# EAGLE design SmartSpeedo (EAGLE 6.4)
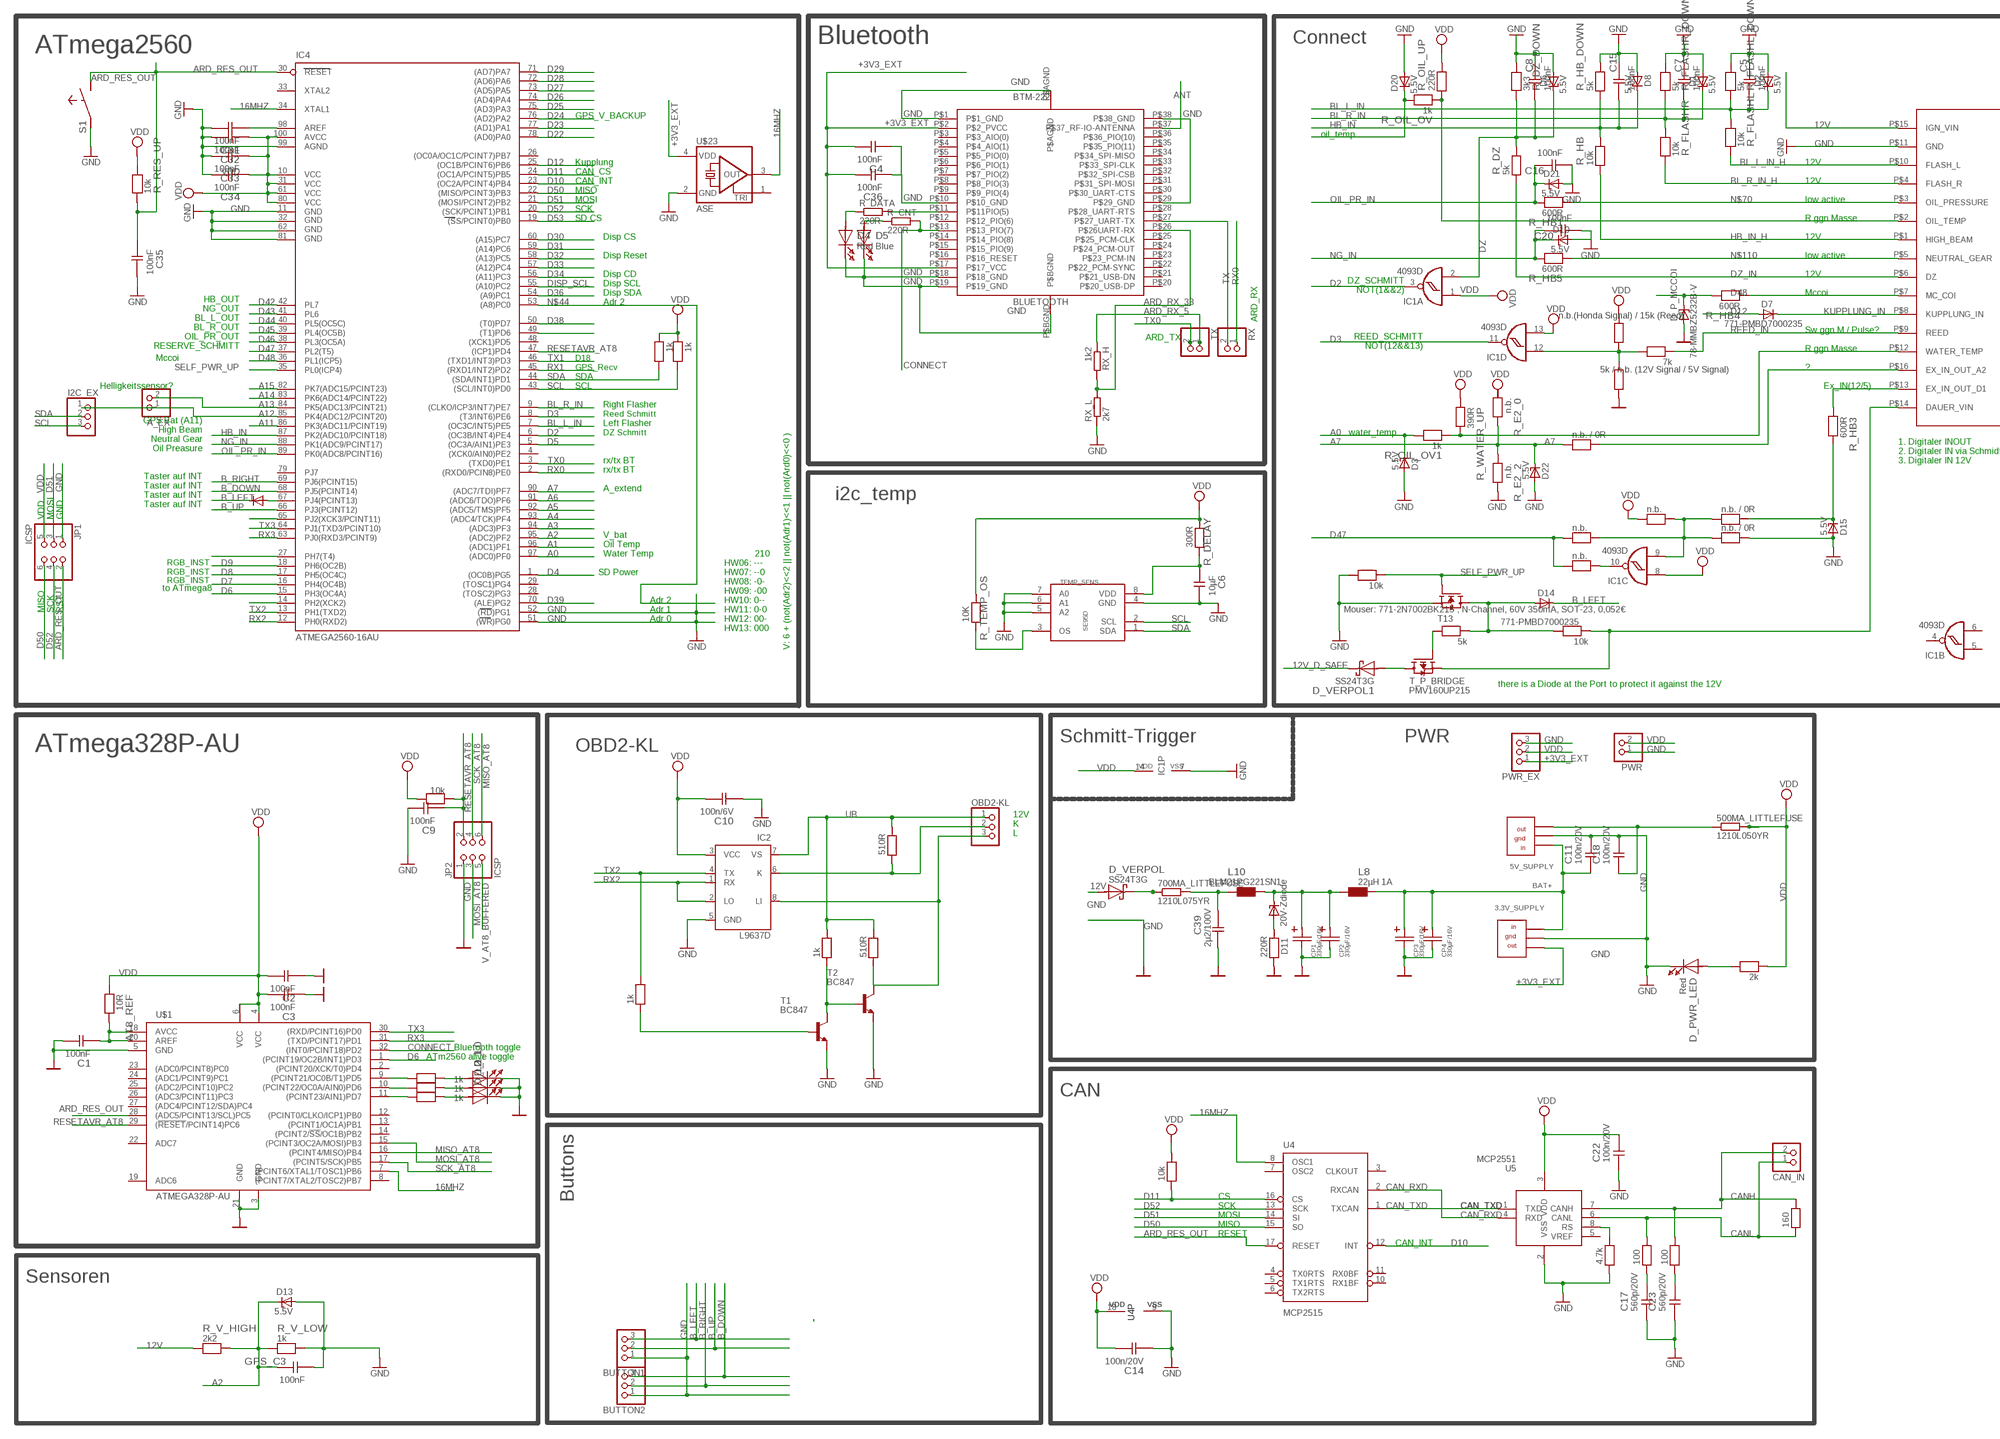
[diagram p0: schematic, sheet 1, part 1 of 2]
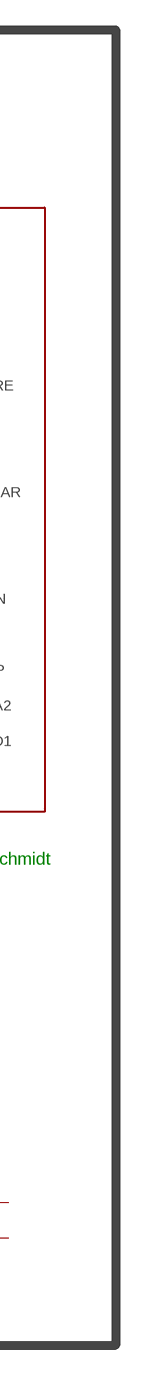
[diagram p1: schematic, sheet 1, part 2 of 2]

## Parts
3.3V_SUPPLY  OKI78SR3.31.5WHC  OKI-78SR  [OKI-78SR]
5V_SUPPLY  OKI78SR51.5W36HC  OKI-78SR  [OKI-78SR]
500MA_LITTLEFUSE  1210L050YR  R-EU_R1210  [R1210]
700MA_LITTLEFUSE  1210L075YR  R-EU_R1210  [R1210]
A_EX  PINHD-1X2  [1X02]
AT8_REF  10R  R0805  [0805]
BLUETOOTH  BTM-222  [BTM-222]
BUTTON1  PINHD-1X3  [1X03]
BUTTON2  PINHD-1X3  [1X03]
C1  100nF  C0805  [0805]
C2  100nF  C0805  [0805]
C3  100nF  C0805  [0805]
C4  100nF  C0805  [0805]
C5  100nF  C0805  [0805]
C6  10µF  C0805  [0805]
C7  100nF  C0805  [0805]
C8  100nF  C0805  [0805]
C9  100nF  C0805  [0805]
C10  100n/6V  C0805  [0805]
C11  100n/20V  C0805  [0805]
C14  100n/20V  C0805  [0805]
C15  100nF  C0805  [0805]
C16  100nF  C0805  [0805]
C17  560p/20V  C0805  [0805]
C18  100n/20V  C0805  [0805]
C20  100nF  C0805  [0805]
C22  100n/20V  C0805  [0805]
C23  560p/20V  C0805  [0805]
C31  100nF  C0805  [0805]
C32  100nF  C0805  [0805]
C33  100nF  C0805  [0805]
C34  100nF  C0805  [0805]
C35  100nF  C0805  [0805]
C36  100nF  C0805  [0805]
C39  2µ2/100V  C0805  [0805]
CAN_IN  PINHD-1X2  [1X02]
CP1  330µF/16V  C_SMD_SMP  [SMD/SMT_6.6/6.6]
CP2  330µF/16V  C_SMD_SMP  [SMD/SMT_6.6/6.6]
CP3  330µF/16V  C_SMD_SMP  [SMD/SMT_6.6/6.6]
CP4  330µF/16V  C_SMD_SMP  [SMD/SMT_6.6/6.6]
D1  5.5V  ZENER-DIODESOT23  [SOT23]
D2  5.5V  ZENER-DIODESOT23  [SOT23]
D3  5.5V  ZENER-DIODESOT23  [SOT23]
D4  Red  LED0805  [LED-0805]
D5  Blue  LED0805  [LED-0805]
D6  5.5V  ZENER-DIODESOT23  [SOT23]
D7  771-PMBD7000235  D-A1-C3  [SOT23]
D8  5.5V  ZENER-DIODESOT23  [SOT23]
D10  5.5V  ZENER-DIODESOT23  [SOT23]
D11  20V-Zdiode  ZENER-DIODESOT23  [SOT23]
D12  771-PMBD7000235  D-A1-C3  [SOT23]
D13  5.5V  ZENER-DIODESOT23  [SOT23]
D14  771-PMBD7000235  D-A1-C3  [SOT23]
D15  5.5V  ZENER-DIODESOT23  [SOT23]
D20  5.5V  ZENER-DIODESOT23  [SOT23]
D21  5.5V  ZENER-DIODESOT23  [SOT23]
D22  5.5V  ZENER-DIODESOT23  [SOT23]
D_L0  LED0805  [LED-0805]
D_L1  LED0805  [LED-0805]
D_L2  LED0805  [LED-0805]
D_P_MCCOI  78-MMBZ5232B-V  ZENER-DIODESOT23  [SOT23]
D_PWR_LED  Red  LED0805  [LED-0805]
D_VERPOL  SS24T3G  D-SSMB-A+K  [SMB]
D_VERPOL1  SS24T3G  D-SSMB-A+K  [SMB]
GPS_C3  100nF  C0805  [0805]
I2C_EX  PINHD-1X3  [1X03]
IC1  4093D  [SO14]
IC2  L9637D  [SO08]
IC4  ATMEGA2560-16AU  [TQFP100]
JP1  ICSP  PINHD-2X3  [2X03]
JP2  ICSP  PINHD-2X3  [2X03]
K_PU  510R  R0805  [0805]
L8  22µH 1A  LPD54  [L-PD54]
L10  BLM21PG221SN1  L0808+0603  [0805+603]
OBD2-KL  PINHD-1X3  [1X03]
PWR  PINHD-1X2  [1X02]
PWR_EX  PINHD-1X3  [1X03]
R1  160  R0805  [0805]
R2  10k  R0805  [0805]
R10  100  R0805  [0805]
R12  100  R0805  [0805]
R13  4.7k  R0805  [0805]
R_CNT  220R  R-EU_M0805  [M0805]
R_DATA  220R  R-EU_M0805  [M0805]
R_DEAKT_DAUER_P  10k  R0805  [0805]
R_DEAKT_DAUER_P1  10k  R0805  [0805]
R_DEAKT_DAUER_P2  5k  R0805  [0805]
R_DELAY  300R  R0805  [0805]
R_DZ  5k  R0805  [0805]
R_DZ_DOWN  3k3  R0805  [0805]
R_E1_0  n.b.  R0805  [0805]
R_E1_1  n.b. / 0R  R0805  [0805]
R_E1_2  n.b.  R0805  [0805]
R_E1_3  n.b. / 0R  R0805  [0805]
R_E1_4  n.b.  R0805  [0805]
R_E2_0  n.b.  R0805  [0805]
R_E2_1  n.b. / 0R  R0805  [0805]
R_E2_2  n.b.  R0805  [0805]
R_FLASHL  10k  R0805  [0805]
R_FLASHL_DOWN  5k  R0805  [0805]
R_FLASHR  10k  R0805  [0805]
R_FLASHR_DOWN  5k  R0805  [0805]
R_HB  10k  R0805  [0805]
R_HB1  600R  R0805  [0805]
R_HB3  600R  R0805  [0805]
R_HB4  600R  R0805  [0805]
R_HB5  600R  R0805  [0805]
R_HB_DOWN  5k  R0805  [0805]
R_L0  1k  R0805  [0805]
R_L1  1k  R0805  [0805]
R_L2  1k  R0805  [0805]
R_L3  10k  R0805  [0805]
R_LED_5V  2k  R0805  [0805]
R_OIL_OV  1k  R0805  [0805]
R_OIL_OV1  1k  R0805  [0805]
R_OIL_UP  220R  R0805  [0805]
R_R_LED_12  220R  R0805  [0805]
R_REED  7k  R0805  [0805]
R_REED_DOWN  5k / n.b. (12V Signal / 5V Signal)  R0805  [0805]
R_REED_UP  n.b.(Honda Signal) / 15k (Reed)  R0805  [0805]
R_RES_UP  10k  R0805  [0805]
R_SCL_UP  1k  R0805  [0805]
R_SDA_UP  1k  R0805  [0805]
R_TEMP_OS  10K  R0805  [0805]
R_V_HIGH  2k2  R0805  [0805]
R_V_LOW  1k  R0805  [0805]
R_WATER_UP  390R  R0805  [0805]
RX  PINHD-1X2  [1X02]
RX_H  1k2  R-EU_M0805  [M0805]
RX_L  2k7  R-EU_M0805  [M0805]
S1  SW-TASTERECO-DIAGONAL  [SW-ECO]
SPEEDOSTECKER  SPEEDOSTECKER  [SPEEDOSTECKER]
T1  BC847  [SOT23]
T2  BC847  [SOT23]
T13  Mouser: 771-2N7002BK215 , N-Channel, 60V 350mA, SOT-23, 0,052€  2N7002  [SOT23]
T_P_BRIDGE  PMV160UP215  [SOT23]
TEMP_SENS  SE95D  [SOIC8]
TX  PINHD-1X2  [1X02]
TX_L  1k  R0805  [0805]
TX_L1  1k  R0805  [0805]
TX_L2  510R  R0805  [0805]
U4  MCP2515  MCP2510SO  [SO-18W]
U5  MCP2551  [SO-08M]
U$1  ATMEGA328P-AU  [TQFP8]
U$23  ASE  [ASE]

## Nets
12V: D_VERPOL.A R_V_HIGH.1 SPEEDOSTECKER.P$15(IGN_VIN)
12V_D_SAFE: 700MA_LITTLEFUSE.1 D_VERPOL1.K D_VERPOL.K
12V_PERMANENT: R_DEAKT_DAUER_P.1 SPEEDOSTECKER.P$14(DAUER_VIN) T_P_BRIDGE.2(S)
12V_SAFE: 700MA_LITTLEFUSE.2 C39.1 L10.1
16MHZ: IC4.34(XTAL1) U4.8(OSC1) U$1.7((PCINT6/XTAL1/TOSC1)PB6) U$23.3(OUT)
+3V3_EXT: 3.3V_SUPPLY.OUT BLUETOOTH.P$2(P$2_PVCC) BLUETOOTH.P$17(P$17_VCC) C4.2 C36.2 PWR_EX.1
A0: D3.3(C) IC4.97((ADC0)PF0) R_OIL_OV1.2
A1: D20.3(C) IC4.96((ADC1)PF1) R_OIL_OV.2
A2: D13.3(C) GPS_C3.2 IC4.95((ADC2)PF2) R_V_HIGH.2 R_V_LOW.1
A3: IC4.94((ADC3)PF3)
A4: IC4.93((ADC4/TCK)PF4)
A5: IC4.92((ADC5/TMS)PF5)
A6: IC4.91((ADC6/TDO)PF6)
A7: D22.3(C) IC4.90((ADC7/TDI)PF7) R_E2_0.2 R_E2_1.2 R_E2_2.1
A11: IC4.86(PK3(ADC11/PCINT19))
A12: A_EX.1 I2C_EX.1 IC4.85(PK4(ADC12/PCINT20))
A13: A_EX.2 IC4.84(PK5(ADC13/PCINT21))
A14: IC4.83(PK6(ADC14/PCINT22))
A15: IC4.82(PK7(ADC15/PCINT23))
ANT: BLUETOOTH.P$37(P$37_RF-IO-ANTENNA)
ARD_RES_OUT: C35.1 IC4.30(RESET) JP1.2 R_RES_UP.1 S1.4 U4.17(RESET) U$1.28((ADC5/PCINT13/SCL)PC5)
ARD_RX_5: RX_H.1 TX.1
ARD_RX_33: BLUETOOTH.P$26(P$26UART-RX) RX_H.2 RX_L.2
B_DOWN: BUTTON2.3 IC4.68(PJ5(PCINT14))
B_LEFT: BUTTON1.3 D12.3(C) D14.3(C)
B_RIGHT: BUTTON2.2 IC4.69(PJ6(PCINT15))
B_UP: BUTTON1.2 IC4.66(PJ3(PCINT12))
BAT+: 3.3V_SUPPLY.IN 5V_SUPPLY.IN C11.1 CP3.POS(PLUS) CP4.POS(PLUS) L8.2
BL_L_IN: C5.1 D2.3(C) IC4.7((OC3C/INT5)PE5) R_FLASHL.2 R_FLASHL_DOWN.1
BL_L_IN_H: R_FLASHL.1 SPEEDOSTECKER.P$10(FLASH_L)
BL_R_IN: C7.1 D1.3(C) IC4.9((CLKO/ICP3/INT7)PE7) R_FLASHR.2 R_FLASHR_DOWN.1
BL_R_IN_H: R_FLASHR.1 SPEEDOSTECKER.P$4(FLASH_R)
CAN_RXD: U4.2(RXCAN) U5.4(RXD)
CAN_TXD: U4.1(TXCAN) U5.1(TXD)
CANH: CAN_IN.2 R1.2 R12.2 U5.7(CANH)
CANL: CAN_IN.1 R1.1 R10.2 U5.6(CANL)
CONNECT: BLUETOOTH.P$13(P$13_PIO(7)) R_CNT.2 U$1.32((INT0/PCINT18)PD2)
D2: IC1.3(A:O) IC4.6((OC3B/INT4)PE4)
D3: IC1.11(D:O) IC4.8((T3/INT6)PE6)
D4: IC4.1((OC0B)PG5)
D5: IC4.5((OC3A/AIN1)PE3)
D6: IC4.15(PH3(OC4A)) U$1.1((PCINT19/OC2B/INT1)PD3)
D7: IC4.16(PH4(OC4B))
D8: IC4.17(PH5(OC4C))
D9: IC4.18(PH6(OC2B))
D10: IC4.23((OC2A/PCINT4)PB4) U4.12(INT)
D11: IC4.24((OC1A/PCINT5)PB5) R2.1 U4.16(CS)
D12: D7.1(A) IC4.25((OC1B/PCINT6)PB6)
D22: IC4.78((AD0)PA0)
D23: IC4.77((AD1)PA1)
D24: IC4.76((AD2)PA2)
D25: IC4.75((AD3)PA3)
D26: IC4.74((AD4)PA4)
D27: IC4.73((AD5)PA5)
D28: IC4.72((AD6)PA6)
D29: IC4.71((AD7)PA7)
D30: IC4.60((A15)PC7)
D31: IC4.59((A14)PC6)
D32: IC4.58((A13)PC5)
D33: IC4.57((A12)PC4)
D34: IC4.56((A11)PC3)
D36: IC4.54((A9)PC1)
D38: IC4.50((T0)PD7)
D39: IC4.70((ALE)PG2)
D42: IC4.42(PL7)
D43: IC4.41(PL6)
D44: IC4.40(PL5(OC5C))
D45: IC4.39(PL4(OC5B))
D46: IC4.38(PL3(OC5A))
D47: IC4.37(PL2(T5)) R_E1_2.2 R_E1_4.2
D48: D_P_MCCOI.3(C) IC4.36(PL1(ICP5)) R_HB4.2
D50: IC4.22((MISO/PCINT3)PB3) JP1.6 U4.15(SO)
D51: IC4.21((MOSI/PCINT2)PB2) JP1.3 U4.14(SI)
D52: IC4.20((SCK/PCINT1)PB1) JP1.4 U4.13(SCK)
D53: IC4.19((SS/PCINT0)PB0)
DISP_SCL: IC4.55((A10)PC2)
DZ: C8.1 D6.3(C) IC1.2(A:I1) R_DZ.2 R_DZ_DOWN.1
DZ_IN: R_DZ.1 SPEEDOSTECKER.P$6(DZ)
GND: 3.3V_SUPPLY.GND 5V_SUPPLY.GND BLUETOOTH.P$1(P$1_GND) BLUETOOTH.P$10(P$10_GND) BLUETOOTH.P$18(P$18_GND) BLUETOOTH.P$19(P$19_GND) BLUETOOTH.P$29(P$29_GND) BLUETOOTH.P$38(P$38_GND) BLUETOOTH.P$AGND BLUETOOTH.P$BGND BUTTON1.1 BUTTON2.1 C1.2 C2.1 C3.1 C4.1 C5.2 C6.2 C7.2 C8.2 C9.2 C10.1 C11.2 C14.1 C15.2 C16.1 C17.1 C18.2 C20.1 C22.1 C23.1 C31.2 C32.2 C33.2 C34.2 C35.2 C36.1 C39.2 CP1.NEG(GND) CP2.NEG(GND) CP3.NEG(GND) CP4.NEG(GND) D1.1(A) D2.1(A) D3.1(A) D4.2(K) D5.2(K) D6.1(A) D8.1(A) D10.1(A) D13.1(A) D15.1(A) D20.1(A) D21.1(A) D22.1(A) D_L0.2(K) D_L1.2(K) D_L2.2(K) D_P_MCCOI.1(A) D_PWR_LED.2(K) GPS_C3.1 IC1.7(P:VSS) IC2.5(GND) IC4.11(GND) IC4.32(GND1) IC4.51((WR)PG0) IC4.52((RD)PG1) IC4.62(GND2) IC4.81(GND3) IC4.99(AGND) JP1.1 JP2.1 PWR.1 PWR_EX.3 R13.1 R_DEAKT_DAUER_P1.2 R_DZ_DOWN.2 R_E1_3.1 R_E2_2.2 R_FLASHL_DOWN.2 R_FLASHR_DOWN.2 R_HB_DOWN.2 R_R_LED_12.1 R_REED_DOWN.2 R_V_LOW.2 RX_L.1 S1.1 SPEEDOSTECKER.P$11(GND) T1.2(E) T2.2(E) T13.2(S) TEMP_SENS.4(GND) TEMP_SENS.5(A2) TEMP_SENS.6(A1) TEMP_SENS.7(A0) U4.9(VSS) U5.2(VSS) U$1.3(GND) U$1.5(GND) U$1.21(GND) U$23.2(GND)
HB_IN: C15.1 D8.3(C) IC4.87(PK2(ADC10/PCINT18)) R_HB.2 R_HB_DOWN.1
HB_IN_H: R_HB.1 SPEEDOSTECKER.P$1(HIGH_BEAM)
KUPPLUNG_IN: D7.3(C) SPEEDOSTECKER.P$8(KUPPLUNG_IN)
MISO_AT8: JP2.6 U$1.16((PCINT4/MISO)PB4)
MOSI_AT8: JP2.3 U$1.15((PCINT3/OC2A/MOSI)PB3)
N999: R_OIL_OV.1 R_OIL_UP.1 SPEEDOSTECKER.P$2(OIL_TEMP)
N$1: CP1.POS(PLUS) CP2.POS(PLUS) D11.3(C) L8.1 L10.2
N$3: AT8_REF.2 C1.1 U$1.18(AVCC) U$1.20(AREF)
N$4: C6.1 R_DELAY.1 TEMP_SENS.8(VDD)
N$5: D5.1(A) R_CNT.1
N$6: IC2.6(K) K_PU.1 OBD2-KL.2
N$7: T1.3(C) T2.1(B) TX_L1.1
N$8: T1.1(B) TX_L.1
N$9: D_PWR_LED.1(A) R_LED_5V.2
N$10: IC2.8(LI) OBD2-KL.3 T2.3(C) TX_L2.1
N$12: D4.1(A) R_DATA.1
N$14: R_L2.1 U$1.11((PCINT23/AIN1)PD7)
N$18: R_L1.1 U$1.10((PCINT22/OC0A/AIN0)PD6)
N$19: 5V_SUPPLY.OUT 500MA_LITTLEFUSE.1 C18.1
N$20: R_L0.1 U$1.9((PCINT21/OC0B/T1)PD5)
N$24: R_DEAKT_DAUER_P2.2 T_P_BRIDGE.1(G)
N$29: IC4.49((T1)PD6)
N$31: IC4.27(PH7(T4))
N$37: C31.1 IC4.98(AREF)
N$38: IC1.9(C:I1) R_E1_0.1 R_E1_1.2 R_E1_2.1 R_E1_3.2
N$40: IC1.10(C:O) R_E1_4.1
N$41: D12.1(A) IC4.67(PJ4(PCINT13))
N$42: R_HB3.1 SPEEDOSTECKER.P$13(EX_IN_OUT_D1)
N$43: R_E2_1.1 SPEEDOSTECKER.P$16(EX_IN_OUT_A2)
N$44: IC4.53((A8)PC0)
N$45: D_VERPOL1.A T_P_BRIDGE.3(D)
N$46: C17.2 R10.1
N$49: IC4.65(PJ2(XCK3/PCINT11))
N$61: IC4.14(PH2(XCK2))
N$70: R_HB1.1 SPEEDOSTECKER.P$3(OIL_PRESSURE)
N$89: C23.2 R12.1
N$90: D15.3(C) R_E1_1.1 R_HB3.2
N$91: R_TEMP_OS.1 TEMP_SENS.3(OS)
N$92: R_HB4.1 SPEEDOSTECKER.P$7(MC_COI)
N$109: D11.1(A) R_R_LED_12.2
N$110: R_HB5.1 SPEEDOSTECKER.P$5(NEUTRAL_GEAR)
N$111: R_OIL_OV1.1 R_WATER_UP.2 SPEEDOSTECKER.P$12(WATER_TEMP)
N$112: R13.2 U5.8(RS)
NET12: D14.1(A) R_DEAKT_DAUER_P2.1 R_DEAKT_DAUER_P.2 T13.3(D)
NG_IN: C20.2 D10.3(C) IC4.88(PK1(ADC9/PCINT17)) R_HB5.2
OIL_PR_IN: C16.2 D21.3(C) IC4.89(PK0(ADC8/PCINT16)) R_HB1.2
P0: D_L0.1(A) R_L0.2
P1: D_L1.1(A) R_L1.2
P2: D_L2.1(A) R_L2.2
REED: IC1.12(D:I0) R_REED.2 R_REED_DOWN.1 R_REED_UP.2
REED_IN: R_REED.1 SPEEDOSTECKER.P$9(REED)
RESETAVR_AT8: C9.1 IC4.47((ICP1)PD4) JP2.2 R_L3.2 U$1.29((!RESET!/PCINT14)PC6)
RX0: IC4.2((RXD0/PCIN8)PE0) RX.1
RX1: IC4.45((RXD1/INT2)PD2)
RX2: IC2.1(RX) IC2.2(LO) IC4.12(PH0(RXD2))
RX3: IC4.63(PJ0(RXD3/PCINT9)) U$1.31((TXD/PCINT17)PD1)
SCK_AT8: JP2.4 U$1.17((PCINT5/SCK)PB5)
SCL: I2C_EX.3 IC4.43((SCL/INT0)PD0) R_SCL_UP.2 TEMP_SENS.2(SCL)
SDA: I2C_EX.2 IC4.44((SDA/INT1)PD1) R_SDA_UP.2 TEMP_SENS.1(SDA)
SELF_PWR_UP: IC4.35(PL0(ICP4)) R_DEAKT_DAUER_P1.1 T13.1(G)
TO_DATA_LED: BLUETOOTH.P$11(P$11PIO(5)) R_DATA.2
TX: BLUETOOTH.P$27(P$27_UART-TX) RX.2
TX0: IC4.3((TXD0)PE1) TX.2
TX1: IC4.46((TXD1/INT3)PD3)
TX2: IC2.4(TX) IC4.13(PH1(TXD2)) TX_L.2
TX3: IC4.64(PJ1(TXD3/PCINT10)) U$1.30((RXD/PCINT16)PD0)
UB: IC2.7(VS) K_PU.2 OBD2-KL.1 TX_L1.2 TX_L2.2
V_AT8_BUFFERED: JP2.5
VDD: 500MA_LITTLEFUSE.2 AT8_REF.1 C2.2 C3.2 C10.2 C14.2 C22.2 C32.1 C33.1 C34.1 IC1.1(A:I0) IC1.8(C:I0) IC1.13(D:I1) IC1.14(P:VDD) IC2.3(VCC) IC4.10(VCC) IC4.31(VCC1) IC4.61(VCC2) IC4.80(VCC3) IC4.100(AVCC) JP1.5 PWR.2 PWR_EX.2 R2.2 R_DELAY.2 R_E1_0.2 R_L3.1 R_LED_5V.1 R_OIL_UP.2 R_REED_UP.1 R_RES_UP.2 R_SCL_UP.1 R_SDA_UP.1 R_TEMP_OS.2 R_WATER_UP.1 U4.18(VDD) U5.3(VDD) U$1.4(VCC) U$1.6(VCC)
Unconnected: BLUETOOTH.P$3(P$3_AIO(0)) BLUETOOTH.P$4(P$4_AIO(1)) BLUETOOTH.P$5(P$5_PIO(0)) BLUETOOTH.P$6(P$6_PIO(1)) BLUETOOTH.P$7(P$7_PIO(2)) BLUETOOTH.P$8(P$8_PIO(3)) BLUETOOTH.P$9(P$9_PIO(4)) BLUETOOTH.P$12(P$12_PIO(6)) BLUETOOTH.P$14(P$14_PIO(8)) BLUETOOTH.P$15(P$15_PIO(9)) BLUETOOTH.P$16(P$16_RESET) BLUETOOTH.P$20(P$20_USB-DP) BLUETOOTH.P$21(P$21_USB-DN) BLUETOOTH.P$22(P$22_PCM-SYNC) BLUETOOTH.P$23(P$23_PCM-IN) BLUETOOTH.P$24(P$24_PCM-OUT) BLUETOOTH.P$25(P$25_PCM-CLK) BLUETOOTH.P$28(P$28_UART-RTS) BLUETOOTH.P$30(P$30_UART-CTS) BLUETOOTH.P$31(P$31_SPI-MOSI) BLUETOOTH.P$32(P$32_SPI-CSB) BLUETOOTH.P$33(P$33_SPI-CLK) BLUETOOTH.P$34(P$34_SPI-MISO) BLUETOOTH.P$35(P$35_PIO(11)) BLUETOOTH.P$36(P$36_PIO(10)) IC1.4(B:O) IC1.5(B:I0) IC1.6(B:I1) IC4.4((XCK0/AIN0)PE2) IC4.26((OC0A/OC1C/PCINT7)PB7) IC4.28((TOSC2)PG3) IC4.29((TOSC1)PG4) IC4.33(XTAL2) IC4.48((XCK1)PD5) IC4.79(PJ7) R_E2_0.1 U4.3(CLKOUT) U4.4(TX0RTS) U4.5(TX1RTS) U4.6(TX2RTS) U4.7(OSC2) U4.10(RX1BF) U4.11(RX0BF) U5.5(VREF) U$1.2((PCINT20/XCK/T0)PD4) U$1.8((PCINT7/XTAL2/TOSC2)PB7) U$1.12((PCINT0/CLKO/ICP1)PB0) U$1.13((PCINT1/OC1A)PB1) U$1.14((PCINT2/!SS!/OC1B)PB2) U$1.19(ADC6) U$1.22(ADC7) U$1.23((ADC0/PCINT8)PC0) U$1.24((ADC1/PCINT9)PC1) U$1.25((ADC2/PCINT10)PC2) U$1.26((ADC3/PCINT11)PC3) U$1.27((ADC4/PCINT12/SDA)PC4) U$23.1(TRI)

## Notes on the sheet
- Bluetooth | Connect
- ATmega2560
- GPS_V_BACKUP
- oil_temp
- Kupplung | 12V
- CAN_CS
- CAN_INT | 12V
- MISO
- MOSI | low active
- SCK
- SD CS | R ggn Masse
- Disp CS | 12V
- Disp Reset | low active
- Disp CD | DZ_SCHMITT | 12V
- Disp SCL | NOT(1&&2)
- HB_OUT | Disp SDA | Mccoi
- NG_OUT | Adr 2
- BL_L_OUT
- BL_R_OUT | ARD_RX
- OIL_PR_OUT | REED_SCHMITT | Sw ggn M / Pulse?
- RESERVE_SCHMITT | ARD_TX | NOT(12&&13)
- R ggn Masse
- Mccoi | D18
- GPS_Recv | ?
- SDA
- Helligkeitssensor? | SCL | Ex_IN(12/5)
- Right Flasher
- GPS Bat (A11) | Reed Schmitt
- High Beam | Left Flasher
- Neutral Gear | DZ Schmitt | water_temp
- Oil Preasure | 1. Digitaler INOUT
- 2. Digitaler IN via Schmidt
- rx/tx BT | 3. Digitaler IN 12V
- Taster auf INT | rx/tx BT
- Taster auf INT
- Taster auf INT | A_extend
- Taster auf INT | i2c_temp
- VDD | MOSI | GND
- V_bat
- Oil Temp
- Water Temp | 210
- RGB_INST
- HW06: ---
- RGB_INST
- RGB_INST | SD Power | HW07: --0
- to ATmega8 | HW08: -0-
- HW09: -00
- Adr 2 | HW10: 0--
- MISO | SCK | RST | Adr 1 | HW11: 0-0
- Adr 0 | HW12: 00-
- HW13: 000
- V: 6 + (not(Adr2)<<2 || not(Adr1)<<1 || not(Ard0)<<0 )
- there is a Diode at the Port to protect it against the 12V
- Schmitt-Trigger | PWR
- ATmega328P-AU | OBD2-KL
- 12V
- K
- L
- Bluetooth toggle
- ATm2560 alive toggle
- CAN
- Buttons | CS
- SCK
- MOSI
- MISO
- RESET
- CAN_INT
- Sensoren

## Power pins joined to a net without a drawn wire
VDD: U$23.4(VDD)

## Library data of the parts
3.3V_SUPPLY 5V_SUPPLY = Kolja:OKI-78SR
500MA_LITTLEFUSE 700MA_LITTLEFUSE RX_H RX_L = resistor:R-EU_: RESISTOR, European symbol
A_EX CAN_IN PWR RX TX = pinhead:PINHD-1X2: PIN HEADER
AT8_REF K_PU R1 R2 R10 R12 R13 R_DEAKT_DAUER_P R_DEAKT_DAUER_P1 R_DEAKT_DAUER_P2 R_DELAY R_DZ R_DZ_DOWN R_E1_0 R_E1_1-R_E1_4 R_E2_0 R_E2_1 R_E2_2 R_FLASHL R_FLASHL_DOWN R_FLASHR R_FLASHR_DOWN R_HB R_HB1 R_HB3-R_HB5 R_HB_DOWN R_L0 R_L1-R_L3 R_LED_5V R_OIL_OV R_OIL_OV1 R_OIL_UP R_R_LED_12 R_REED R_REED_DOWN R_REED_UP R_RES_UP R_SCL_UP R_SDA_UP R_TEMP_OS R_V_HIGH R_V_LOW R_WATER_UP TX_L TX_L1 TX_L2 = RCLDT:R
BLUETOOTH = btm-222:BTM-222: Rayson BTM-222 Bluetooth Modul all Pins
BUTTON1 BUTTON2 I2C_EX OBD2-KL PWR_EX = pinhead:PINHD-1X3: PIN HEADER
C1-C11 C14-C18 C20 C22 C23 C31-C36 C39 GPS_C3 = RCLDT:C
CP1-CP4 = Kolja:C_SMD_SMP: Mouser:667-EEE-1CA331UP
D1-D3 D6 D8 D10 D11 D13 D15 D20-D22 D_P_MCCOI = diode:ZENER-DIODE: Z-Diode
D4 D5 D_L0 D_L1 D_L2 D_PWR_LED = OPTO:LED
D7 D12 D14 = semicon-smd-ipc:D-: DIODE unfilled
D_VERPOL D_VERPOL1 = RCLDT:D-S
IC1 = 40xx:4093: Quad 2-input NAND schmitt trigger
IC2 = st-microelectronics:L9637D: ISO 9141 INTERFACE Source: 1765.pdf; MPN: L9637D; OC_FARNELL: unknown; OC_NEWARK: 56P8926
IC4 = atmel-2005:ATMEGA*: MICROCONTROLLER 64/128/256 Kbytes FLASH 4 Kbytes EEPROM 8 Kbytes SRAM 86 General Purpose I/O pins 12-channels16-bit PWM 4 x Serial USARTs 16-channels 10-bit A/D
JP1 JP2 = pinhead:PINHD-2X3: PIN HEADER
L8 L10 = RCLDT:L
R_CNT R_DATA = rcl:R-EU_: RESISTOR, European symbol
S1 = SWITCH+RELAIS:SW-TASTER
SPEEDOSTECKER = Kolja:SPEEDOSTECKER
T1 T2 = transistor:BC847: NPN TRANSISTOR
T13 = Kolja:2N7002: Mouser: 771-2N7002BK215 , N-Channel, 60V 350mA, SOT-23, 0,052€
T_P_BRIDGE = Kolja:PMV160UP215: PMV160UP215, - 1.2 A, 210mOhm Rds on, 0,061€
TEMP_SENS = Kolja:SE95D: Mouser 771-SE95D118, 0,559€, SOIC8
U4 = microchip_can:MCP2510
U5 = skpang_lib:MCP2551
U$1 = Kolja:ATMEGA328P-AU
U$23 = crystal:ASE: 3.3Vdc CMOS SMD CRYSTAL CLOCK OSCILLATOR SOurce: www.abracon.com; OC_FARNELL: unknown; OC_NEWARK: unknown

## Net classes
0 default: width 0.18 mm, drill 0.3 mm, clearance 0.15 mm

## Board
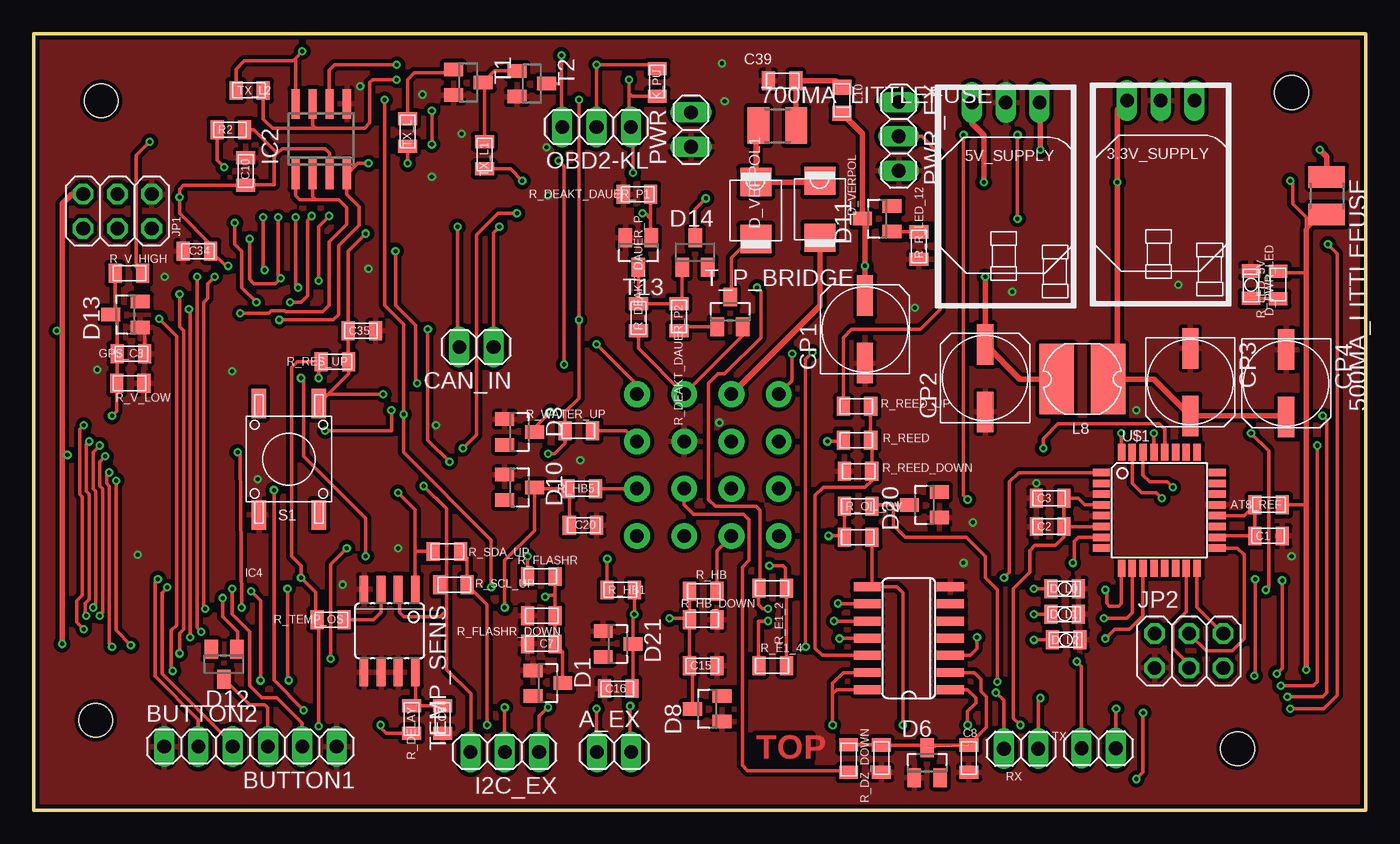
[diagram p2: board, top side]
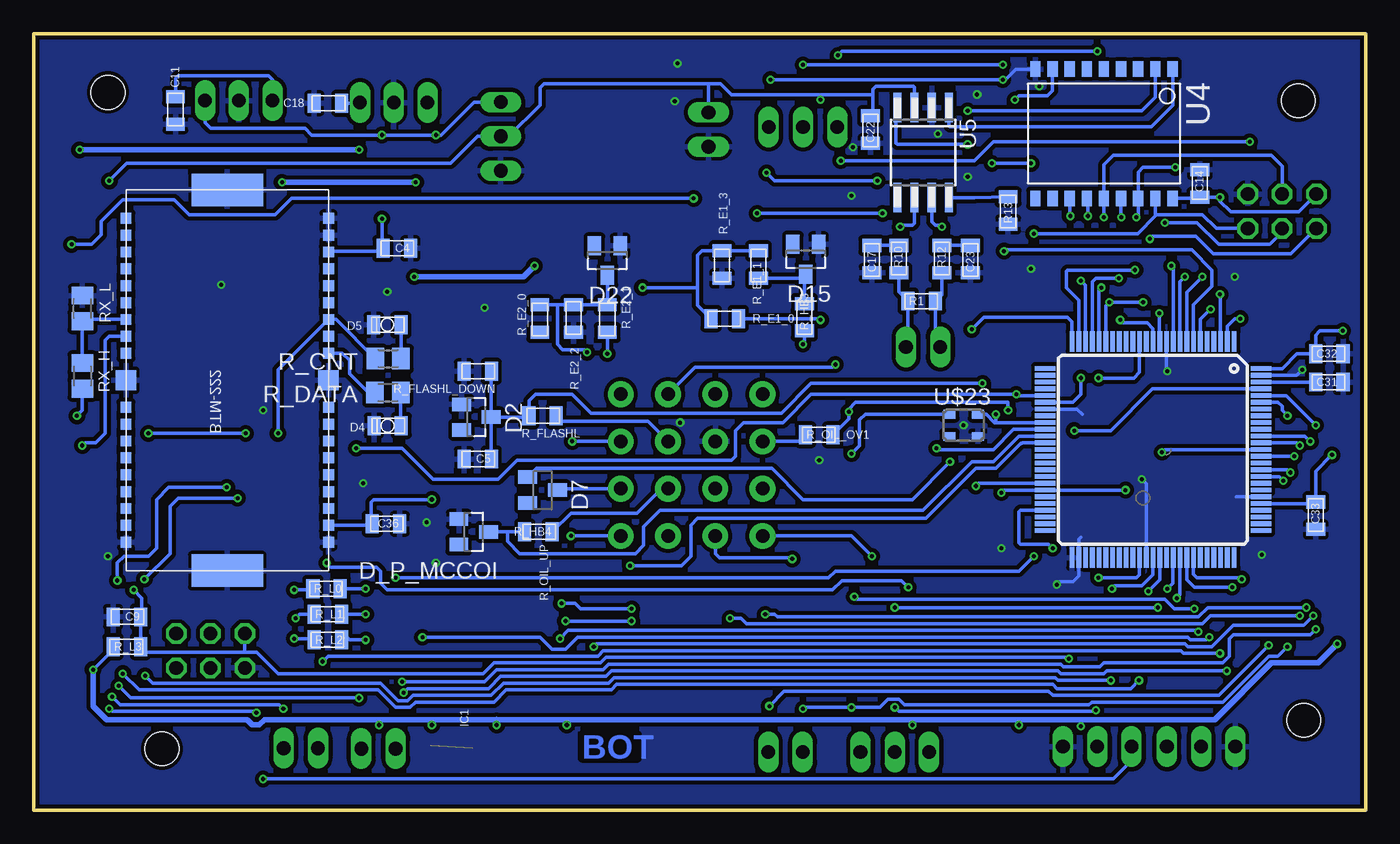
[diagram p3: board, bottom side, seen from below]

Size 98.7 x 57.5 mm. Coordinates in mm from the lower left corner, seen from the top.
Outline: 0,0 0,57.5 98.7,57.5 98.7,0 0,0
Copper layers (1*2*15*16): Top 0.035mm / dielectric 0.2mm / Route2 0.0175mm / dielectric 1.1mm / Route15 0.0175mm / dielectric 0.2mm / Bottom 0.035mm
Design rules "SeeedStudio_DRU_no_angle_20130527 *": minimum track width 6mil, minimum drill 11mil, track to track 6mil, track to pad 6mil, pad to pad 6mil, via to via 6mil, smd to smd 0mil, copper to edge 10mil, drill to drill 10mil, minimum pad ring 6mil, minimum via ring 6mil, stop-mask expansion 2mil, vias tented up to drill 25mil, thermal gap 10mil
Holes 2.5 mm at 4.6,6.65 89.2,4.55 93.2,53.15 5,52.55
tKeepout: area 1.1,3.1 to 8.1,10.1; area 85.7,1 to 92.7,8; area 89.7,49.6 to 96.7,56.6; area 1.5,49 to 8.5,56

### Footprints (pad centres in the part's own frame; a part is rotated, then mirrored left to right if it is on the bottom)
OKI-78SR = drill 1 long: GND 0,-6.95; IN 2.5,-6.95; OUT -2.5,-6.95
R1210 = smd 1.6 x 2.7: 1 -1.4,0; 2 1.4,0
1X02 = drill 1.016 long: 1 -1.27,0; 2 1.27,0
0805 = smd 0.965 x 1.397: 1 -1.016,0; 2 1.016,0
BTM-222 = smd 0.8 x 0.8: P$1 -12.635,-7.5; P$2 -11.385,-7.5; P$3 -10.135,-7.5; P$4 -8.885,-7.5; P$5 -7.635,-7.5; P$6 -6.385,-7.5; P$7 -5.135,-7.5; P$8 -3.885,-7.5; P$9 -2.635,-7.5; P$11 1.365,-7.5; P$12 2.615,-7.5; P$13 3.865,-7.5; P$14 5.115,-7.5; P$15 6.365,-7.5; P$16 7.615,-7.5; P$17 8.865,-7.5; P$18 10.115,-7.5; P$19 11.365,-7.5; P$20 11.365,7.5; P$21 10.115,7.5; P$22 8.865,7.5; P$23 7.615,7.5; P$24 6.365,7.5; P$25 5.115,7.5; P$26 3.865,7.5; P$27 2.615,7.5; P$28 1.365,7.5; P$30 -2.635,7.5; P$31 -3.885,7.5; P$32 -5.135,7.5; P$33 -6.385,7.5; P$34 -7.635,7.5; P$35 -8.885,7.5; P$36 -10.135,7.5; P$37 -11.385,7.5; P$38 -12.635,7.5 | smd 1.5 x 1.5: P$10 -0.635,-7.5; P$29 -0.635,7.5 | smd 2.4 x 5.3: P$AGND -14.735,0; P$BGND 13.465,0
1X03 = drill 1.016 long: 1 -2.54,0; 2 0,0; 3 2.54,0
SMD/SMT_6.6/6.6 = smd 3 x 1.2: NEG -2.5,0; POS 2.5,0
SOT23 = smd 1 x 1.4: 1 -0.95,-1.1; 2 0.95,-1.1; 3 0,1.1
LED-0805 = smd 0.965 x 1.397: 1 -1.016,0; 2 1.016,0
SMB = smd 2.1 x 2.3: A -2.114,0; K 2.114,0
SO14 = smd 0.66 x 2.032: 1 -3.81,-3.073; 2 -2.54,-3.073; 3 -1.27,-3.073; 4 0,-3.073; 5 1.27,-3.073; 6 2.54,-3.073; 7 3.81,-3.073; 8 3.81,3.073; 9 2.54,3.073; 10 1.27,3.073; 11 0,3.073; 12 -1.27,3.073; 13 -2.54,3.073; 14 -3.81,3.073
SO08 = smd 0.6 x 2.2: 1 -1.905,-2.6; 2 -0.635,-2.6; 3 0.635,-2.6; 4 1.905,-2.6; 5 1.905,2.6; 6 0.635,2.6; 7 -0.635,2.6; 8 -1.905,2.6
TQFP100 = smd 1.5 x 0.35: 1 -8,6; 2 -8,5.5; 3 -8,5; 4 -8,4.5; 5 -8,4; 6 -8,3.5; 7 -8,3; 8 -8,2.5; 9 -8,2; 10 -8,1.5; 11 -8,1; 12 -8,0.5; 13 -8,0; 14 -8,-0.5; 15 -8,-1; 16 -8,-1.5; 17 -8,-2; 18 -8,-2.5; 19 -8,-3; 20 -8,-3.5; 21 -8,-4; 22 -8,-4.5; 23 -8,-5; 24 -8,-5.5; 25 -8,-6; 51 8,-6; 52 8,-5.5; 53 8,-5; 54 8,-4.5; 55 8,-4; 56 8,-3.5; 57 8,-3; 58 8,-2.5; 59 8,-2; 60 8,-1.5; 61 8,-1; 62 8,-0.5; 63 8,0; 64 8,0.5; 65 8,1; 66 8,1.5; 67 8,2; 68 8,2.5; 69 8,3; 70 8,3.5; 71 8,4; 72 8,4.5; 73 8,5; 74 8,5.5; 75 8,6 | smd 0.35 x 1.5: 26 -6,-8; 27 -5.5,-8; 28 -5,-8; 29 -4.5,-8; 30 -4,-8; 31 -3.5,-8; 32 -3,-8; 33 -2.5,-8; 34 -2,-8; 35 -1.5,-8; 36 -1,-8; 37 -0.5,-8; 38 0,-8; 39 0.5,-8; 40 1,-8; 41 1.5,-8; 42 2,-8; 43 2.5,-8; 44 3,-8; 45 3.5,-8; 46 4,-8; 47 4.5,-8; 48 5,-8; 49 5.5,-8; 50 6,-8; 76 6,8; 77 5.5,8; 78 5,8; 79 4.5,8; 80 4,8; 81 3.5,8; 82 3,8; 83 2.5,8; 84 2,8; 85 1.5,8; 86 1,8; 87 0.5,8; 88 0,8; 89 -0.5,8; 90 -1,8; 91 -1.5,8; 92 -2,8; 93 -2.5,8; 94 -3,8; 95 -3.5,8; 96 -4,8; 97 -4.5,8; 98 -5,8; 99 -5.5,8; 100 -6,8
2X03 = drill 1.016 octagon: 1 -2.54,-1.27; 2 -2.54,1.27; 3 0,-1.27; 4 0,1.27; 5 2.54,-1.27; 6 2.54,1.27
L-PD54 = smd 2.54 x 5.2: 1 -1.905,0; 2 1.905,0
0805+603 = smd 1.11 x 1.43: 1 -0.953,0; 2 0.953,0
M0805 = smd 1.3 x 1.6: 1 -0.95,0; 2 0.95,0
SW-ECO = smd 2.184 x 1.067: 1 -4.128,2.223; 2 -4.128,-2.223; 3 4.128,2.223; 4 4.128,-2.223
SPEEDOSTECKER = drill 1 pad 1.9: P$1 -2,5.5; P$2 -5.5,5.5; P$3 1.5,5.5; P$4 5,5.5; P$5 5,2; P$6 1.5,2; P$7 -2,2; P$8 -5.5,2; P$9 -5.5,-1.5; P$10 -2,-1.5; P$11 1.5,-1.5; P$12 5,-1.5; P$13 5,-5; P$14 1.5,-5; P$15 -2,-5; P$16 -5.5,-5
SOIC8 = smd 0.66 x 2.032: 1 -1.975,-3.143; 2 -0.705,-3.143; 3 0.565,-3.143; 4 1.835,-3.143; 5 1.835,3.003; 6 0.565,3.003; 7 -0.705,3.003; 8 -1.975,3.003
SO-18W = smd 0.762 x 1.143: 1 -5.08,-4.788; 2 -3.81,-4.788; 3 -2.54,-4.788; 4 -1.27,-4.788; 5 0,-4.788; 6 1.27,-4.788; 7 2.54,-4.788; 8 3.81,-4.788; 9 5.08,-4.788; 10 5.08,4.788; 11 3.81,4.788; 12 2.54,4.788; 13 1.27,4.788; 14 0,4.788; 15 -1.27,4.788; 16 -2.54,4.788; 17 -3.81,4.788; 18 -5.08,4.788
SO-08M = smd 0.6 x 2.2: 1 -1.905,-3.33; 2 -0.635,-3.33; 3 0.635,-3.33; 4 1.905,-3.33; 5 1.905,3.33; 6 0.635,3.33; 7 -0.635,3.33; 8 -1.905,3.33
TQFP8 = smd 1.27 x 0.559: 1 -4.293,2.8; 2 -4.293,2; 3 -4.293,1.2; 4 -4.293,0.4; 5 -4.293,-0.4; 6 -4.293,-1.2; 7 -4.293,-2; 8 -4.293,-2.8; 17 4.293,-2.8; 18 4.293,-2; 19 4.293,-1.2; 20 4.293,-0.4; 21 4.293,0.4; 22 4.293,1.2; 23 4.293,2; 24 4.293,2.8 | smd 0.559 x 1.27: 9 -2.8,-4.293; 10 -2,-4.293; 11 -1.2,-4.293; 12 -0.4,-4.293; 13 0.4,-4.293; 14 1.2,-4.293; 15 2,-4.293; 16 2.8,-4.293; 25 2.8,4.293; 26 2,4.293; 27 1.2,4.293; 28 0.4,4.293; 29 -0.4,4.293; 30 -1.2,4.293; 31 -2,4.293; 32 -2.8,4.293
ASE = smd 0.9 x 0.65: 1 -1.05,-0.825; 2 1.05,-0.825; 3 1.05,0.825; 4 -1.05,0.825

### Placement (x,y rotation side)
3.3V_SUPPLY  83.5,45.6 180 top
5V_SUPPLY  72.03,45.45 180 top
500MA_LITTLEFUSE  95.8,45.5 270 top
700MA_LITTLEFUSE  55.1,50.7 0 top
A_EX  43,4.3 0 top
AT8_REF  91.5,22.6 180 top
BLUETOOTH  84.36,32.47 90 bottom
BUTTON1  19.9,4.7 180 top
BUTTON2  12.2,4.7 0 top
C1  91.5,20.3 0 top
C2  75.3,21 0 top
C3  75.3,23.1 0 top
C4  71.8,41.6 180 bottom
C5  65.8,26 180 bottom
C6  30.3,6.7 270 top
C7  37.6,12.3 180 top
C8  69.3,3.8 270 top
C9  91.8,14.3 180 bottom
C10  15.7,47.3 270 top
C11  88.2,51.83 270 bottom
C14  12.3,46.4 270 bottom
C15  49.6,10.7 0 top
C16  43.3,9 0 top
C17  36.6,40.8 90 bottom
C18  76.9,52.35 180 bottom
C20  40.7,21.1 180 top
C22  36.7,50.4 90 bottom
C23  29.3,40.8 90 bottom
C31  2.7,31.7 0 bottom
C32  2.7,33.8 0 bottom
C33  3.7,21.8 270 bottom
C34  12.1,41.4 180 top
C35  24.3,35.5 0 top
C36  72.6,21.2 180 bottom
C39  55.45,54.01 180 top
CAN_IN  32.8,34.3 180 top
CP1  61.6,35.6 90 top
CP2  70.5,32 90 top
CP3  85.7,31.7 270 top
CP4  92.8,31.6 270 top
D1  38.1,9.4 270 top
D2  65.9,29.1 270 bottom
D3  36,28 270 top
D4  72.48,28.47 180 bottom
D5  72.5,35.94 180 bottom
D6  66.2,3.5 0 top
D7  61,23.7 270 bottom
D8  49.9,7.5 90 top
D10  36,23.9 270 top
D11  62.5,43.8 90 top
D12  14.1,10.8 180 top
D13  6.8,36.7 90 top
D14  49,41.3 0 top
D15  41.5,40.8 180 bottom
D20  66,22.6 90 top
D21  43.3,12.3 270 top
D22  56.2,40.7 180 bottom
D_L0  76.4,16.4 0 top
D_L1  76.4,14.5 0 top
D_L2  76.5,12.6 0 top
D_P_MCCOI  66.1,20.6 270 bottom
D_PWR_LED  90.2,38.91 90 top
D_VERPOL  58.25,44.5 90 top
D_VERPOL1  53.5,44.4 90 top
GPS_C3  7.2,33.8 180 top
I2C_EX  34.9,4.3 180 top
IC1  64.85,12.73 90 top
IC2  21.3,49.7 0 top
IC4  15.76,26.7 270 bottom
JP1  6.2,44.35 180 top
JP2  85.6,11.8 0 top
K_PU  46.2,53.9 270 top
L8  77.7,31.92 0 top
L10  59.88,52.58 270 top
OBD2-KL  41.7,50.6 180 top
PWR  48.7,50.4 90 top
PWR_EX  64.1,49.9 270 top
R1  32.9,37.7 0 bottom
R2  14.6,50.4 0 top
R10  34.6,40.8 270 bottom
R12  31.4,40.8 270 bottom
R13  26.5,44.4 90 bottom
R_CNT  72.44,33.44 180 bottom
R_DATA  72.46,30.93 180 bottom
R_DEAKT_DAUER_P  44.8,36.5 90 top
R_DEAKT_DAUER_P1  44.7,45.6 180 top
R_DEAKT_DAUER_P2  47.8,36.5 270 top
R_DELAY  28,6.7 270 top
R_DZ  60.39,3.81 90 top
R_DZ_DOWN  62.8,3.8 270 top
R_E1_0  47.5,36.4 0 bottom
R_E1_1  45,40.4 90 bottom
R_E1_2  54.75,16.44 0 top
R_E1_3  47.7,40.4 90 bottom
R_E1_4  54.75,10.7 0 top
R_E2_0  61.2,36.4 90 bottom
R_E2_1  56.2,36.4 90 bottom
R_E2_2  58.7,36.4 270 bottom
R_FLASHL  61,29.2 180 bottom
R_FLASHL_DOWN  65.8,32.5 180 bottom
R_FLASHR  37.6,17.3 0 top
R_FLASHR_DOWN  37.6,14.4 180 top
R_HB  49.6,16.2 180 top
R_HB1  43.5,16.3 0 top
R_HB3  41.6,36.5 90 bottom
R_HB4  61.3,20.6 180 bottom
R_HB5  40.6,23.8 180 top
R_HB_DOWN  49.6,14.1 0 top
R_L0  77,16.4 0 bottom
R_L1  76.9,14.5 0 bottom
R_L2  76.9,12.6 0 bottom
R_L3  91.8,12.1 0 bottom
R_LED_5V  92.2,38.88 270 top
R_OIL_OV  61.1,22.5 0 top
R_OIL_OV1  40.5,27.8 0 bottom
R_OIL_UP  61.1,20.2 0 top
R_R_LED_12  65.6,41.8 90 top
R_REED  61,27.4 0 top
R_REED_DOWN  61.08,25.1 180 top
R_REED_UP  61,29.9 0 top
R_RES_UP  22.3,33.2 180 top
R_SCL_UP  31.1,16.68 180 top
R_SDA_UP  30.6,19.15 180 top
R_TEMP_OS  22,14.1 180 top
R_V_HIGH  7.05,39.75 180 top
R_V_LOW  7.15,31.6 0 top
R_WATER_UP  40.4,28.1 0 top
RX  73.16,4.54 0 top
RX_H  95.09,32.16 90 bottom
RX_L  95.09,37.16 270 bottom
S1  18.91,26 90 top
SPEEDOSTECKER  49.7,25.8 180 top
T1  32.2,53.9 270 top
T2  36.9,53.8 270 top
T13  44.8,41.3 180 top
T_P_BRIDGE  51.6,36.9 0 top
TEMP_SENS  26.3,13.2 180 top
TX  78.92,4.58 180 top
TX_L  27.7,50.2 270 top
TX_L1  33.4,48.5 270 top
TX_L2  16,53.3 0 top
U4  19.4,50.1 180 bottom
U5  32.8,48.7 180 bottom
U$1  83.4,22.2 0 top
U$23  29.8,28.5 0 bottom

### Tracks (layer width: path | path; a pad name or v marks a point on that pad's centre or on a via)
12V  (via drill 0.3)
  Top 0.254: v38.9,48.1 39.3,47.7 v39.3,33 | R_V_HIGH.1 7.6,40.22 7.6,48.5 v8.6,49.5
  Top 0.406: SPEEDOSTECKER.P$15 58.25,37.35 D_VERPOL.A
  Bottom 0.254: v38.9,48.1 29,48.1 27.6,49.5 v8.6,49.5 | v39.3,33 39.5,32.8 49.7,32.8 SPEEDOSTECKER.P$15
12V_D_SAFE
  Top 0.254: 700MA_LITTLEFUSE.1 53.7,50.8 53.5,51
  Top 0.406: D_VERPOL.K 58.15,46.51 D_VERPOL1.K 53.5,51 53.5,51.28
12V_PERMANENT
  Top 0.254: R_DEAKT_DAUER_P.1 44.8,34.2 SPEEDOSTECKER.P$14 52.55,35.15 T_P_BRIDGE.2
12V_SAFE
  Top 0.254: 700MA_LITTLEFUSE.2 56.5,51.88 56.47,51.91
  Top 0.406: L10.1 59.4,54.01 C39.1 56.47,51.91
16MHZ  (via drill 0.3)
  Top 0.254: v26,52.6 26,37.4 27.4,36 v27.4,29.3 27.4,26.5 33.9,20 v33.9,16.5 | U$1.7 77.4,20.2 77.1,19.9 77.1,18.4 v77,18.3
  Bottom 0.254: IC4.34 27.4,28.7 | U4.8 23.21,53.29 23.6,52.9 25.7,52.9 v26,52.6 | v27.4,29.3 27.4,28.7 | v33.9,16.5 34.4,17 38.8,17 39.5,16.3 72.5,16.3 73,16.8 73,17.7 73.3,18 76.7,18 v77,18.3 | 27.4,28.7 27.5,28.7 28.12,29.32 U$23.3
+3V3_EXT  (via drill 0.3)
  Top 0.254: v72.9,43.8 v72.9,50 | v69.2,23 68.9,23.3 v68.9,50
  Bottom 0.254: 76.89,41.3 BLUETOOTH.P$17 76.8,41.4 73.02,41.4 C4.2 72.9,41.68 v72.9,43.8 | v69.2,23 73.5,23 73.7,22.8 73.7,21.28 C36.2 arc90 73.73,21.09 BLUETOOTH.P$2 | 3.3V_SUPPLY.OUT 86,50.9 85.6,50.5 78.6,50.5 78.1,50 v72.9,50 v68.9,50 68.5,50 66.06,52.44 PWR_EX.1
A0  (via drill 0.3)
  Top 0.254: v21.6,28.1 26.5,28.1 v26.5,29.6 | D3.3 37.1,28.3 v38.3,29.5
  Bottom 0.254: v26.5,29.6 26.5,30.2 37.8,30.2 38.3,29.7 v38.3,29.5 38.3,28.98 R_OIL_OV1.2 | v21.6,28.1 18.9,28.1 15.8,31.2 IC4.97
A1  (via drill 0.3)
  Top 0.254: 63.6,22.6 63.7,22.5 63.7,21.1 64.6,20.2 69.1,20.2 70.5,18.8 70.5,17.2 71.4,16.3 v71.4,9.5 | 63.6,22.6 D20.3 | R_OIL_OV.2 62.22,22.6 63.6,22.6 | v3.7,13.4 3.2,13.9 3.2,15.5 3.6,15.9 3.6,23.2 3.4,23.4 3.4,28.2 v3.7,28.5
  Bottom 0.254: IC4.96 5.9,30.7 v3.7,28.5 | v71.4,9.5 65.3,9.5 64.4,10.4 56.5,10.4 56.1,10.8 22.6,10.8 22.4,10.6 19.7,10.6 19.4,10.9 10.6,10.9 10.1,11.4 10.1,12.7 9.8,13 4.1,13 v3.7,13.4
A2  (via drill 0.3)
  Top 0.254: v5.8,29.2 6.13,29.53 R_V_LOW.1 6.18,31.65 GPS_C3.2 6.2,33.82 6.2,36.2 D13.3 6.03,37.03 R_V_HIGH.2
  Bottom 0.254: v5.8,29.2 6.2,29.6 6.2,29.9 6.5,30.2 IC4.95
A7  (via drill 0.3)
  Top 0.254: v57.2,12.1 57.2,33.4 v57.7,33.9 | v4.1,27.3 3.9,27.1 3.9,23.6 4.1,23.4 4.1,15.6 3.8,15.3 3.8,14.5 v3.9,14.4
  Bottom 0.254: D22.3 R_E2_1.2 R_E2_2.1 60,37.42 | R_E2_0.2 60,37.42 | 60,37.42 59.9,37.32 59.9,34.5 59.5,34.1 57.9,34.1 v57.7,33.9 | IC4.90 4.5,27.7 v4.1,27.3 | v57.2,12.1 57,12.3 13.4,12.3 13.2,12.1 11.4,12.1 9.8,13.7 4.6,13.7 v3.9,14.4
A12  (via drill 0.3)
  Top 0.254: I2C_EX.1 37.44,6.94 v38.1,7.6 | v5.6,25 5.4,24.8 5.4,24.2 5.6,24 5.6,12.3 v5.8,12.1 | A_EX.1 41.7,4.33 v41.7,7.5
  Bottom 0.254: IC4.85 5.8,25.2 v5.6,25 | v5.8,12.1 6.5,11.4 7.2,11.4 10.6,8 20.3,8 20.5,7.8 34.2,7.8 34.6,8.2 35.4,8.2 36,7.6 v38.1,7.6 41.6,7.6 v41.7,7.5
A13  (via drill 0.3)
  Top 0.254: v6.1,24.4 6.1,13.3 v7.2,12.2 | v44.2,7.7 44.2,4.37 A_EX.2
  Bottom 0.254: IC4.84 6.4,24.7 v6.1,24.4 | v7.2,12.2 10.9,8.5 23.2,8.5 23.5,8.8 43.1,8.8 v44.2,7.7
ARD_RES_OUT  (via drill 0.3)
  Top 0.254: v24.6,42.7 23.3,41.4 23.3,35.6 | 23.3,35.6 23.3,33.2 R_RES_UP.1 23.32,32.31 21.81,30.8 | C35.1 23.32,35.62 23.3,35.6 | S1.4 21.81,30.8 | v25.9,30.8 21.81,30.8 | v74.8,26.8 74.8,27.5 75.9,28.6 83.4,28.6 83.8,28.2 U$1.28
  Bottom 0.254: U4.17 15.59,44.2 | 15.59,44.2 15.59,44.01 16.9,42.7 v24.6,42.7 | IC4.30 25.8,30.7 v25.9,30.8 41.1,30.8 43.2,28.7 46.1,28.7 46.7,28.1 46.7,26.2 47,25.9 62.9,25.9 64.3,24.5 69.1,24.5 71.4,26.8 v74.8,26.8 | JP1.2 11.08,43.08 12.1,44.1 15.49,44.1 15.59,44.2
ARD_RX_5  (via drill 0.3)
  Top 0.254: v95.5,29.2 95.8,28.9 95.8,8.7 95.5,8.4 v92.9,8.4 | TX.1 80.19,7.49 v80.2,7.5
  Bottom 0.254: v95.5,29.2 95.09,29.61 RX_H.1 | v92.9,8.4 92.3,7.8 80.5,7.8 v80.2,7.5
ARD_RX_33
  Bottom 0.254: RX_H.2 RX_L.2 94.96,36.34 BLUETOOTH.P$26
B_DOWN  (via drill 0.3)
  Top 0.254: v9.9,16.5 9.5,16.1 9.5,10.1 14.74,4.86 BUTTON2.3
  Bottom 0.254: IC4.68 13.26,17.06 12.7,16.5 v9.9,16.5
B_LEFT  (via drill 0.3)
  Top 0.254: D14.3 49,44.5 v49.8,45.3 | v95.9,41.9 96.6,41.2 96.6,8.5 95.6,7.5 v93.1,7.5 | D12.3 16,7.8 17.1,7.8 17.33,7.57 17.33,4.73 BUTTON1.3 | v82.2,7.2 82.2,2.8 v81.7,2.3
  Bottom 0.254: v49.8,45.3 79.6,45.3 80.8,44.1 87.2,44.1 88.3,45.2 92.1,45.2 93.7,43.6 93.7,42.6 94.4,41.9 v95.9,41.9 | v81.7,2.3 18.7,2.3 17.33,3.67 17.33,4.67 BUTTON1.3 | v82.2,7.2 82.3,7.3 92.9,7.3 v93.1,7.5
B_RIGHT  (via drill 0.3)
  Top 0.254: v9.2,17.1 9,16.9 9,9.9 12.2,6.7 BUTTON2.2
  Bottom 0.254: IC4.69 12.76,17.46 12.5,17.2 9.3,17.2 v9.2,17.1
B_UP  (via drill 0.3)
  Top 0.254: v14.7,16.4 14.7,14.5 16,13.2 16,9.2 16.9,8.3 18,8.3 19.87,6.43 19.87,4.73 BUTTON1.2
  Bottom 0.254: IC4.66 14.26,18.54 14.3,18.5 14.3,16.8 v14.7,16.4
BAT+  (via drill 0.3)
  Top 0.406: 3.3V_SUPPLY.IN 80.3,51.85 v80.3,46.5 80.3,32.11 80.41,32.01 80,31.6 | 80,31.6 79.8,31.4 | CP4.POS 92.7,29.2 CP3.POS 82.98,31.92 L8.2 79.68,31.92 80,31.6 | 5V_SUPPLY.IN 69.53,50.88 70.4,50 v70.4,46.5
  Bottom 0.254: C11.1 88.2,54.2 88,54.4 81.3,54.4 81,54.1 3.3V_SUPPLY.IN
  Bottom 0.406: v70.4,46.5 v80.3,46.5
BL_L_IN  (via drill 0.3)
  Top 0.254: v26.8,41.4 26.8,37.4 28.3,35.9 28.3,31.7 v28.4,31.6
  Bottom 0.254: D2.3 62.12,29.1 R_FLASHL.2 62,29.22 62,30.3 61.5,30.8 58.8,30.8 57.4,29.4 43.3,29.4 41.1,31.6 v28.4,31.6 | D2.3 64.8,26.02 C5.1 | D2.3 64.8,32.48 R_FLASHL_DOWN.1 | v26.8,41.4 26.7,41.5 12.9,41.5 11.4,40 11.4,38.8 12.76,37.44 IC4.7
BL_L_IN_H
  Bottom 0.254: 59.88,29.1 R_FLASHL.1 59.58,28.8 53.2,28.8 SPEEDOSTECKER.P$10
BL_R_IN  (via drill 0.3)
  Top 0.254: R_FLASHR.2 38.62,15.9 | 38.62,15.9 R_FLASHR_DOWN.1 C7.1 39.2,11.72 D1.3 | v37.9,15.8 38,15.9 38.62,15.9 | 13.3,39.4 v13.4,39.5 12.9,39 12.9,37.9 12.6,37.6 12.6,15 v12.7,14.9
  Bottom 0.254: IC4.9 13.76,39.14 v13.4,39.5 | v12.7,14.9 14.2,14.9 14.9,15.6 37.7,15.6 v37.9,15.8
BL_R_IN_H  (via drill 0.3)
  Top 0.254: v36.6,18.8 36.6,17.32 R_FLASHR.1
  Bottom 0.254: SPEEDOSTECKER.P$4 38.1,20.3 v36.6,18.8
CAN_RXD  (via drill 0.3)
  Top 0.254: v29.5,49.3 v29.5,51.8
  Bottom 0.254: v29.5,49.3 34.7,49.3 34.8,49.4 34.8,51.94 U5.4 | v29.5,51.8 16.6,51.8 15.6,52.8 15.6,54.88 U4.2
CAN_TXD
  Bottom 0.254: U5.1 30.89,50.7 30.8,50.6 15.9,50.6 14.3,52.2 14.3,54.87 U4.1
CANH  (via drill 0.3)
  Top 0.254: CAN_IN.2 31.4,34.43 v31.4,43.2
  Bottom 0.254: CAN_IN.2 31.88,34.65 R1.2 31.4,38.18 R12.2 | U5.7 32.16,43.56 31.9,43.3 31.5,43.3 v31.4,43.2
CANL  (via drill 0.3)
  Top 0.254: CAN_IN.1 34.07,42.77 v34.5,43.2
  Bottom 0.254: CAN_IN.1 33.92,34.45 R1.1 34.6,38.38 R10.2 | U5.6 33.44,43.47 33.6,43.3 34.4,43.3 v34.5,43.2
CONNECT  (via drill 0.3)
  Top 0.254: U$1.32 v80.6,27.9
  Bottom 0.254: R_CNT.2 76.28,36.34 BLUETOOTH.P$13 80.6,32.59 v80.6,27.9
D2  (via drill 0.3)
  Top 0.254: IC1.3 69.4,11.46 69.9,11.96 v69.9,12.8 | v11.6,12.8 11.6,37 v11.5,37.1
  Bottom 0.254: IC4.6 12.26,36.34 v11.5,37.1 | v11.6,12.8 11.8,12.6 13,12.6 13.2,12.8 58.4,12.8 59.3,11.9 60.3,11.9 61.2,12.8 v69.9,12.8
D3  (via drill 0.3)
  Top 0.254: v12.1,39.5 12.1,13.5 v12.4,13.2 | IC1.11 59.73,12.73 v59.7,12.7
  Bottom 0.254: v12.1,39.5 13.26,38.34 IC4.8 | v12.4,13.2 12.5,13.3 59.1,13.3 v59.7,12.7
D6  (via drill 0.3)
  Top 0.254: v71.9,17.2 72.3,17.6 72.3,24.3 73,25 U$1.1 | v24.6,18.8 24.6,21.6 20,26.2 20,31.8 v19.8,32
  Bottom 0.254: v71.9,17.2 39.8,17.2 39.3,17.7 25.7,17.7 v24.6,18.8 | v19.8,32 17.2,32 16.76,32.44 IC4.15
D10  (via drill 0.3)
  Top 0.254: v21.1,39.2 21.1,43.2 v21.9,44
  Bottom 0.254: IC4.23 20.76,38.86 v21.1,39.2 | v21.9,44 21.94,44.04 U4.12
D11  (via drill 0.3)
  Top 0.254: v17,43.9 17,40.1 v17.1,40 | R2.1 13.58,48.12 v14.1,47.6
  Bottom 0.254: v17,43.9 16.86,44.04 U4.16 16.86,47.24 16.5,47.6 v14.1,47.6 | v17.1,40 22.1,40 22.2,39.9 22.2,38.7 21.26,37.76 IC4.24
D12  (via drill 0.3)
  Top 0.254: v29.2,35.6 29.2,27.4 v30.8,25.8
  Bottom 0.254: IC4.25 21.76,36.16 22.1,36.5 28.3,36.5 v29.2,35.6 | D7.1 61.45,25.3 44,25.3 41.7,23 33.6,23 v30.8,25.8
D47  (via drill 0.3)
  Top 0.254: v54.5,18.1 55.5,18.1 55.7,17.9 55.7,16.51 R_E1_2.2 R_E1_4.2
  Bottom 0.254: IC4.37 25.39,27.2 arc-45 25.57,27.13 27.4,25.3 28.9,25.3 32.6,21.6 49.5,21.6 50,21.1 50,18.8 50.7,18.1 v54.5,18.1
D48
  Bottom 0.254: IC4.36 25.7,27.7 27.6,25.8 29.2,25.8 32.8,22.2 52.3,22.2 53.5,21 53.5,19.6 54.1,19 62.7,19 63.6,19.9 63.6,20.6 | 63.6,20.6 R_HB4.2 | D_P_MCCOI.3 63.6,20.6
D50  (via drill 0.3)
  Top 0.254: v18.1,43.9 18.1,39.6 v18.3,39.4 17.9,39 16.3,39 16,39.3 v16,42.3
  Bottom 0.254: U4.15 18.13,43.93 v18.1,43.9 | v18.3,39.4 20,39.4 20.26,39.14 IC4.22 | v16,42.3 15.8,42.5 12.6,42.5 11.3,41.2 5.54,41.2 JP1.6
D51  (via drill 0.3)
  Top 0.254: v19.6,38.7 19.4,38.9 v19.4,43.9
  Bottom 0.254: IC4.21 19.76,38.54 v19.6,38.7 | v19.4,43.9 U4.14 19.4,47.8 18.7,48.5 7,48.5 6.2,47.7 JP1.3
D52  (via drill 0.3)
  Top 0.254: v19,37.6 19.8,37.6 20.3,38.1 20.3,43.7 v20.6,44 | v14.9,43.5 14.9,41.9 15.4,41.4 15.4,38.7 v16.5,37.6
  Bottom 0.254: IC4.20 19.26,37.34 v19,37.6 v16.5,37.6 | v20.6,44 20.6,45.24 U4.13 | JP1.4 6.2,42.8 7.1,41.9 10.9,41.9 12.5,43.5 v14.9,43.5
DZ  (1 unrouted)
  Top 0.254: IC1.2 69.71,10.19 70.2,9.7 70.2,8.8 70.6,8.4 70.6,6.12 C8.1 R_DZ_DOWN.1 | 62.71,4.92 R_DZ_DOWN.1 | R_DZ.2 R_DZ_DOWN.1
DZ_IN
  Top 0.254: SPEEDOSTECKER.P$6 48.2,22.6 48.9,21.9 52.6,21.9 53,21.5 53,18.5 52.5,18 52.5,3.3 52.9,2.9 60.38,2.9 R_DZ.1
GND  (via drill 0.3)
  Top 0.254: GPS_C3.1 8.22,35.43 D13.1
  Bottom 0.254: IC4.81 9.6,23.2 | IC4.99 5.1,32.2 v4.7,32.6 | IC4.62 16.26,24.16 v16.6,24.5 | v14.7,32.5 14.76,32.56 IC4.11 | IC4.32 21.4,29.7 21,29.3 | U4.9 25.91,54.89 26.9,53.9 | v22.9,16.7 22.7,16.9 21.7,16.9 21.26,17.34 IC4.52 21.26,20.04 21.1,20.2
  other vias: 7.7,18.9 9.7,39.5 24.8,40.1 50.8,28.7 29.8,28.5 40.5,25.9 72.5,38.4 84.8,38.9 74.3,24.2 81.7,29.6 29.5,46.9 38.1,45.5 51.2,52.5 51,55.3 38,49.1 28.8,53 24.2,53.6 27,19.4 69.6,21.3 68.9,18.3 65.3,37.2 31.7,50.1 93.2,18.8
  pour Top (isolate 0.305): 0,0 98.6,0 98.6,57 0,57
  pour Bottom (isolate 0.305): 0,0 98.6,0 98.6,57 0,57
HB_IN  (via drill 0.3)
  Top 0.254: v5.3,26.2 4.9,25.8 4.9,24 5.1,23.8 5.1,14.6 v4.9,14.4 | D8.3 48.8,10.48 C15.1 R_HB_DOWN.1 | R_HB_DOWN.1 R_HB.2 | 48.28,13.8 R_HB_DOWN.1 | v47.1,14.2 48.48,14.2 R_HB_DOWN.1
  Bottom 0.254: IC4.87 v5.3,26.2 | v4.9,14.4 11.5,14.4 12.1,13.8 45.9,13.8 46.3,14.2 v47.1,14.2
HB_IN_H
  Top 0.254: R_HB.1 50.62,19.22 SPEEDOSTECKER.P$1
KUPPLUNG_IN
  Bottom 0.254: SPEEDOSTECKER.P$8 59.8,23.8 D7.3
MISO_AT8
  Top 0.254: JP2.6 86.2,15.01 U$1.16
MOSI_AT8
  Top 0.254: U$1.15 85.4,14.7 84.4,13.7 84.4,12 85.6,10.8 JP2.3
N999  (via drill 0.3)
  Top 0.254: v58.9,20.3 59.98,20.3 R_OIL_UP.1 R_OIL_OV.1
  Bottom 0.254: SPEEDOSTECKER.P$2 v58.9,20.3
N$1  (via drill 0.3)
  Top 0.406: CP1.POS v61.6,40.3 61.6,43.6 D11.3 61.4,50.11 L10.2 | v70.5,39.5 CP2.POS 73.08,31.92 L8.1
  Bottom 0.406: v70.5,39.5 62.4,39.5 v61.6,40.3
N$3
  Top 0.254: U$1.20 89.68,21.8 AT8_REF.2 90.48,20.38 90.4,20.3 | 90.4,20.3 C1.1 | U$1.18 87.79,20.3 90.4,20.3
N$4
  Top 0.254: TEMP_SENS.8 28.3,10.17 28.3,8.02 R_DELAY.1 C6.1
N$5
  Bottom 0.254: R_CNT.1 D5.1
N$6  (via drill 0.3)
  Top 0.254: OBD2-KL.2 v41.7,55.2 45.92,55.2 K_PU.1 | v26.9,55.2 22.3,55.2 21.9,54.8 21.9,52.34 IC2.6
  Bottom 0.254: v41.7,55.2 v26.9,55.2
N$7
  Top 0.254: T2.1 34.15,54.75 T1.3 33.4,53.8 TX_L1.1
N$8
  Top 0.254: TX_L.1 27.7,54.1 28.2,54.6 30.85,54.6 T1.1
N$9
  Top 0.254: D_PWR_LED.1 90.23,37.86 R_LED_5V.2
N$10  (via drill 0.3)
  Top 0.254: IC2.8 19.39,55.7 | 19.39,55.7 v19.9,56.2 | v39.1,55.9 39.1,53.8 | 39.1,53.8 39.1,50.66 OBD2-KL.3 | T2.3 39.1,53.8 | TX_L2.1 14.98,54.88 15.6,55.5 19.2,55.5 19.39,55.7
  Bottom 0.254: v19.9,56.2 38.8,56.2 v39.1,55.9
N$12
  Bottom 0.254: D4.1 71.51,28.47 R_DATA.1
N$14  (via drill 0.3)
  Top 0.254: U$1.11 82.2,14.4 81.2,13.4 80.1,13.4 v79.4,12.7
  Bottom 0.254: v79.4,12.7 78.02,12.7 R_L2.1
N$18  (via drill 0.3)
  Top 0.254: U$1.10 81.4,14.6 81,14.2 v79.3,14.2
  Bottom 0.254: R_L1.1 79,14.5 v79.3,14.2
N$19  (via drill 0.3)
  Top 0.406: v74.6,48.9 74.6,52.33 5V_SUPPLY.OUT | 500MA_LITTLEFUSE.1 95.8,48.4 v95.3,48.9
  Bottom 0.254: C18.1 74.58,52.35 5V_SUPPLY.OUT
  Bottom 0.406: v95.3,48.9 v74.6,48.9
N$20  (via drill 0.3)
  Top 0.254: U$1.9 80.6,15.3 80.4,15.1 79.7,15.1 79.5,15.3 79.5,16.2 v79.4,16.3
  Bottom 0.254: v79.4,16.3 78.12,16.3 R_L0.1
N$24
  Top 0.254: R_DEAKT_DAUER_P2.2 48.12,35.8 T_P_BRIDGE.1
N$37
  Bottom 0.254: IC4.98 C31.1
N$38  (via drill 0.3)
  Top 0.254: R_E1_2.1 53.56,16.44 53.5,16.5 | v53.6,38.7 53.9,38.4 53.9,35 51.2,32.3 50.7,32.3 50,31.6 50,23 50.5,22.5 53.5,22.5 53.8,22.2 53.8,16.51 R_E1_2.1 | IC1.9 59.73,15.27 v59.6,15.3 | v54.4,14.9 54,14.9 53.7,15.2 53.7,16.41 R_E1_2.1
  Bottom 0.254: R_E1_1.2 R_E1_3.2 49.18,41.42 49.5,41.1 49.5,38.6 | 49.5,38.6 49.5,37.38 R_E1_0.1 | v53.6,38.7 49.6,38.7 49.5,38.6 | v59.6,15.3 58.6,15.3 58.2,14.9 v54.4,14.9
N$40  (via drill 0.3)
  Top 0.254: IC1.10 59.4,14 v59.3,14 | v54.4,14 53.7,14 53.7,10.73 R_E1_4.1
  Bottom 0.254: v59.3,14 v54.4,14
N$41  (via drill 0.3)
  Top 0.254: v14,15.7 14,14.3 15.1,13.2 15.1,11.95 D12.1
  Bottom 0.254: IC4.67 13.76,15.94 v14,15.7
N$42  (via drill 0.3)
  Top 0.254: v41.7,34.5 44.7,31.5 SPEEDOSTECKER.P$13
  Bottom 0.254: R_HB3.1 41.6,34.6 v41.7,34.5
N$43  (via drill 0.3)
  Top 0.254: SPEEDOSTECKER.P$16 56.2,31.8 v56.2,33.8
  Bottom 0.254: v56.2,33.8 R_E2_1.1
N$45
  Top 0.254: T_P_BRIDGE.3 51.7,38.1 51.7,40.9 53.09,42.29 D_VERPOL1.A
N$46
  Bottom 0.254: R10.1 C17.2
N$70  (via drill 0.3)
  Top 0.254: v42.5,18.6 42.48,18.58 R_HB1.1
  Bottom 0.254: SPEEDOSTECKER.P$3 48.2,19 47.9,18.7 42.6,18.7 v42.5,18.6
N$89
  Bottom 0.254: R12.1 C23.2
N$90
  Bottom 0.254: 41.55,37.57 R_HB3.2 41.6,39.7 | R_E1_1.1 41.72,39.38 41.72,39.7 41.6,39.7 | D15.3 41.6,39.7
N$91
  Top 0.254: R_TEMP_OS.1 25.2,14.1 25.73,14.63 TEMP_SENS.3
N$92
  Bottom 0.254: R_HB4.1 58.88,22 54,22 52.2,23.8 SPEEDOSTECKER.P$7
N$109
  Top 0.254: R_R_LED_12.2 D11.1
N$110
  Top 0.254: R_HB5.1 SPEEDOSTECKER.P$5
N$111
  Top 0.254: R_WATER_UP.2 43.9,28.1 SPEEDOSTECKER.P$12
  Bottom 0.254: SPEEDOSTECKER.P$12 42.02,27.3 R_OIL_OV1.1
N$112
  Bottom 0.254: U5.8 29.01,45.37 R13.2
NET12
  Top 0.254: D14.1 48.05,37.77 R_DEAKT_DAUER_P2.1 R_DEAKT_DAUER_P.2 T13.3
NG_IN  (via drill 0.3)
  Top 0.254: C20.2 39.68,23.7 R_HB5.2 37.2,23.8 D10.3 37.1,20.7 34.9,18.5 v34.9,15 | v15.1,26.5 15.3,26.3 v15.4,15
  Bottom 0.254: v15.4,15 v34.9,15 | IC4.88 14.9,26.7 v15.1,26.5
OIL_PR_IN  (via drill 0.3)
  Top 0.254: R_HB1.2 44.5,16.28 v44.5,14.5 44.4,14.4 D21.3 | D21.3 44.5,11.9 | D21.3 44.4,9.08 C16.2 | v4.9,27 4.4,26.5 4.4,23.8 4.6,23.6 4.6,15.2 v4.4,15
  Bottom 0.254: v4.4,15 11.7,15 12.4,14.3 43.6,14.3 43.8,14.5 v44.5,14.5 | IC4.89 5.1,27.2 v4.9,27
P0  (via drill 0.3)
  Top 0.254: v74.1,16.4 D_L0.1
  Bottom 0.254: R_L0.2 v74.1,16.4
P1  (via drill 0.3)
  Top 0.254: v74.1,14.5 D_L1.1
  Bottom 0.254: R_L1.2 v74.1,14.5
P2  (via drill 0.3)
  Top 0.254: D_L2.1 v74.1,12.6
  Bottom 0.254: R_L2.2 75.58,12.9 75.28,12.6 v74.1,12.6
REED
  Top 0.254: R_REED_UP.2 R_REED.2 62.09,27.32 R_REED_DOWN.1 62.1,24.4 61.6,23.9 58.5,23.9 57.9,23.3 57.9,12 58.44,11.46 IC1.12
REED_IN  (via drill 0.3)
  Top 0.254: v58.8,27.3 59.88,27.3 R_REED.1
  Bottom 0.254: SPEEDOSTECKER.P$9 v58.8,27.3
RESETAVR_AT8  (via drill 0.3)
  Top 0.254: U$1.29 v83,27.9 | v91.3,16.3 91.5,16.5 91.5,26.6 v90.2,27.9 | v23.2,19.4 22,18.2 v22,11.2
  Bottom 0.254: IC4.47 25.6,22.2 25.7,22.1 25.7,19.8 25.6,19.7 23.5,19.7 v23.2,19.4 | JP2.2 83.06,11.84 83.2,11.7 | v22,11.2 22.1,11.3 56.3,11.3 56.7,10.9 64.6,10.9 65.4,10.1 80.6,10.1 82.2,11.7 83.2,11.7 | v83,27.9 v90.2,27.9 | 83.2,11.7 90.38,11.7 R_L3.2 C9.1 90.7,14.38 90.7,15.7 v91.3,16.3
RX0  (via drill 0.3)
  Top 0.254: v71.3,8.7 71.89,8.12 RX.1 | v10.3,10.3 10.2,10.4 10.2,13.3 10.6,13.7 10.6,35.1 v9.3,36.4
  Bottom 0.254: IC4.2 10.26,35.84 9.7,36.4 v9.3,36.4 | v10.3,10.3 19.2,10.3 19.4,10.1 22.6,10.1 22.8,10.3 55.9,10.3 56.3,9.9 64.1,9.9 65,9 71,9 v71.3,8.7
RX2  (via drill 0.3)
  Top 0.254: IC2.2 20.66,45.44 20.9,45.2 | 20.9,45.2 22.6,45.2 23.2,44.6 23.2,43.4 21.9,42.1 21.9,37.4 21.4,36.9 18.7,36.9 18.6,37 17.6,37 17.4,36.8 v15.3,36.8 | IC2.1 19.39,45.51 19.7,45.2 20.9,45.2
  Bottom 0.254: IC4.12 15.3,34.74 v15.3,36.8
RX3  (via drill 0.3)
  Top 0.254: U$1.31 81.4,24.2 82.1,23.5 83.2,23.5 v83.6,23.1 | v18.8,16.4 18.8,9.7 v18.9,9.6 | v90.5,17.1 90.5,10 v90.45,9.95
  Bottom 0.254: IC4.63 15.76,17.44 16.6,16.6 18.6,16.6 v18.8,16.4 | v18.9,9.6 22.8,9.6 23,9.8 55.7,9.8 56.1,9.4 63.9,9.4 64.8,8.5 70.6,8.5 71,8.1 71.7,8.1 73,9.4 89.9,9.4 v90.45,9.95 | v90.5,17.1 88.6,19 88.6,22.5 88,23.1 v83.6,23.1
SCK_AT8
  Top 0.254: JP2.4 86.87,11.8 88.8,11.8 89.7,12.7 89.7,18.9 89.2,19.4 U$1.17
SCL  (via drill 0.3)
  Top 0.254: v28.9,24 30.6,22.3 30.6,16.6 | 30.6,16.6 30.6,14.8 | 30.6,14.8 30.1,14.3 27.4,14.3 27.1,14.6 27.1,16.25 TEMP_SENS.2 | R_SCL_UP.2 30.08,16.62 30.1,16.6 30.6,16.6 | 30.6,14.8 30.6,10.4 32.4,8.6 32.4,4.34 I2C_EX.3
  Bottom 0.254: IC4.43 28.7,24.2 v28.9,24
SDA  (via drill 0.3)
  Top 0.254: v27,23.5 28.27,22.23 28.27,19.2 | TEMP_SENS.1 28.27,19.2 | R_SDA_UP.2 28.32,19.15 28.27,19.2 | I2C_EX.2 v34.9,7.6 | v17.8,23.7 17.8,9.6 v20,7.4
  Bottom 0.254: v27,23.5 26.8,23.7 IC4.44 v17.8,23.7 | v34.9,7.6 34.6,7.3 20.1,7.3 v20,7.4
SELF_PWR_UP  (via drill 0.3)
  Top 0.254: v31.8,26.8 32.8,27.8 32.8,42.6 34.4,44.2 v35.8,44.2 | T13.1 45.72,42.43 45.72,43.8 | 45.72,43.8 R_DEAKT_DAUER_P1.1 | v45.1,44.2 45.32,44.2 45.72,43.8
  Bottom 0.254: IC4.35 26.1,28.2 27.6,26.7 31.7,26.7 v31.8,26.8 | v35.8,44.2 v45.1,44.2
TO_DATA_LED
  Bottom 0.254: R_DATA.2 73.93,30.93 75.3,32.3 75.3,33.3 75.83,33.84 BLUETOOTH.P$11
TX  (via drill 0.3)
  Top 0.254: v95.1,27 95.1,9.5 94.8,9.2 v92.4,9.2 | RX.2 74.42,8.12 v74.6,8.3
  Bottom 0.254: BLUETOOTH.P$27 93.11,35.09 93.4,34.8 93.4,27.9 94.1,27.2 94.9,27.2 v95.1,27 | v74.6,8.3 91.5,8.3 v92.4,9.2
TX0  (via drill 0.3)
  Top 0.254: v10.8,11.6 10.8,13.1 11.1,13.4 11.1,35.5 10.8,35.8 v10.8,38.2 | TX.2 77.64,10.65 v77.3,11
  Bottom 0.254: v10.8,11.6 13.5,11.6 13.7,11.8 56.5,11.8 56.9,11.4 76.9,11.4 v77.3,11 | v10.8,38.2 10.76,38.16 IC4.3
TX2  (via drill 0.3)
  Top 0.254: v18.2,36.3 22.2,36.3 22.6,36.7 22.6,41.8 24.1,43.3 24.1,44.7 23.2,45.6 IC2.4 24,47.9 v24.8,47.9 | v27.7,47.9 TX_L.2
  Bottom 0.254: IC4.13 15.76,35.66 16.2,36.1 18,36.1 v18.2,36.3 | v24.8,47.9 v27.7,47.9
TX3  (via drill 0.3)
  Top 0.254: U$1.30 82.2,24.8 82.7,24.3 84,24.3 v84.4,23.9 | v16.8,9.6 16.8,15.5 v16.1,16.2 | v92.1,10.1 92.5,10.5 v92.5,17
  Bottom 0.254: IC4.64 15.26,17.04 v16.1,16.2 | v92.5,17 92.5,18.3 92,18.8 90.2,18.8 89.6,19.4 89.6,23 88.7,23.9 v84.4,23.9 | v16.8,9.6 17.4,9 22.9,9 23.2,9.3 55.5,9.3 55.9,8.9 63.7,8.9 64.6,8 70.4,8 70.8,7.6 71.9,7.6 73.2,8.9 90.9,8.9 v92.1,10.1
UB  (via drill 0.3)
  Top 0.254: IC2.7 20.66,50.73 20.9,50.5 | 20.9,50.5 24.5,50.5 24.9,50.9 24.9,53.9 25.1,54.1 v26.9,54.1 | v44.1,54.1 44.1,53.1 | 44.1,53.1 44.1,50.74 OBD2-KL.1 44.4,50.44 v44.4,47.2 | K_PU.2 44.32,52.88 44.1,53.1 | TX_L2.2 17.02,51.18 17.7,50.5 20.9,50.5 | TX_L1.2 35.32,47.48 v36.2,46.6
  Bottom 0.254: v26.9,54.1 v44.1,54.1 | v36.2,46.6 43.8,46.6 v44.4,47.2
VDD  (via drill 0.3)
  Top 0.254: v73.1,6.3 72.6,6.8 72.6,16.4 73.8,17.6 73.8,19.2 74.2,19.6 75.7,19.6 76.32,20.22 C2.2 | v2.5,26.3 2.3,26.5 2.1,26.6 | v33.6,6.3 33.6,15.19 R_SCL_UP.1 32.12,18.65 R_SDA_UP.1 | v1.7,35.5 2.1,35.5 | R_REED_UP.1 59.98,32.78 60,32.8 60,35 60.6,35.6 65.68,35.6 67.15,37.07 67.15,48.55 65.8,49.9 PWR_EX.2 | v21.1,32 21.1,33.02 R_RES_UP.2 19.5,33.2 19.1,32.8 19.1,18.8 19.8,18.1 v19.8,17.2 20.88,16.12 20.88,14.2 R_TEMP_OS.2 21.1,13.98 v21.1,6.2 | v38.1,26.4 38.6,26.4 39.38,27.18 R_WATER_UP.1 39.38,29.48 40.4,30.5 v40.4,36.3 v40.4,52.6 | R_DELAY.2 26.12,5.68 25.7,6.1 v25.7,6.3 | AT8_REF.1 94.2,22.6 94.3,22.5 | IC1.14 61.76,8.9 59.5,8.9 59.2,8.6 | IC1.13 59.99,10.19 59.2,9.4 59.2,8.6 | IC1.1 69.18,8.92 69.8,8.3 69.8,7.9 69.2,7.3 v69.2,6.3 | v64.4,6.3 64.4,16.1 63.96,16.54 IC1.8 62.12,16.88 R_OIL_UP.2 | 59.2,8.6 v59.2,6.3 | v14.4,40.3 14.22,40.3 C34.1 13.12,41.88 10.8,44.2 v10.8,45.38 10.8,46 11.08,46.28 C10.2 15.72,46.3 17.8,46.3 17.8,48.4 18.05,48.65 | IC2.3 21.93,48.66 21.6,49 18.4,49 18.05,48.65 | C2.2 C3.2 77.4,23.1 77.9,22.6 U$1.4 | U$1.6 C2.2 | R_LED_5V.1 92.29,39.8 94.3,39.8 | R2.2 16.3,50.4 18.05,48.65 | 500MA_LITTLEFUSE.2 95.41,44.1 94.3,42.99 | v93.1,46.6 93.3,46.4 93.3,44.9 94.3,43.9 94.3,42.9
  Top 0.406: v2.1,12.3 2.1,26.6 2.1,35.5 2.1,44.9 2.82,45.62 JP1.5 | 94.3,42.99 94.3,42.9 94.3,39.8 94.3,22.5 v94.3,10.4
  Bottom 0.254: v33.6,6.3 33.6,6.7 | IC4.80 3.82,22.7 C33.1 3.7,25.1 v2.5,26.3 | v25.7,6.3 25.7,6.7 | U4.18 12.37,45.31 C14.2 v10.8,45.38 10.8,45.1 10,44.3 4.98,44.3 JP1.5 | v73.1,6.3 73.1,6.7 | IC4.61 16.76,17.44 17,17.2 v19.8,17.2 | IC4.100 6.2,32.7 5.1,33.8 C32.1 3.72,35.18 3.4,35.5 v1.7,35.5 | R_E1_0.2 40.5,36.4 v40.4,36.3 | IC4.31 21.7,30.2 21.1,30.8 v21.1,32 | U$23.4 37.08,29.32 37.5,28.9 37.5,27 v38.1,26.4 | 48.8,53.8 60.9,53.8 61.2,53.5 61.2,52.2 63.5,49.9 PWR_EX.2 65.8,49.9 67.8,47.9 91.8,47.9 v93.1,46.6 | PWR.2 48.7,53.7 48.8,53.8 | v64.4,6.3 64.4,6.8 64.5,6.7 | v59.2,6.3 59.2,6.7 | U5.3 33.44,53.53 33.5,53.6 36.3,53.6 36.5,53.4 36.5,53 | 36.5,53 36.5,51.62 C22.2 | 48.8,53.8 47.8,53.8 47,53 40.3,53 | 40.3,53 36.5,53 | v40.4,52.6 40.4,52.9 40.3,53 | IC4.10 14.26,40.16 v14.4,40.3 | v69.2,6.3 69.2,6.5 69.4,6.7 | v21.1,6.2 21.1,6.5 21.3,6.7 | R_L3.1 92.82,11.88 v94.3,10.4
  Bottom 0.406: v94.3,10.4 94.3,7.7 93.3,6.7 82.9,6.7 82.5,6.3 82,6.3 81.6,6.7 73.1,6.7 69.4,6.7 64.5,6.7 59.2,6.7 33.6,6.7 25.7,6.7 21.3,6.7 11.2,6.7 7,10.9 3.5,10.9 v2.1,12.3

### Text on the board
Top: TOP
Bottom: BOT
tStop: SmartSpeedo 1.0